# EasyEDA Pro project 连续波核磁共振.eprj

# Schematic CNMR-D-02
Create Date: 2023-07-25; Page Name: P1; Project Name: 连续波核磁共振; Schematic Name: CNMR-D-02; Update Date: 2024-09-05
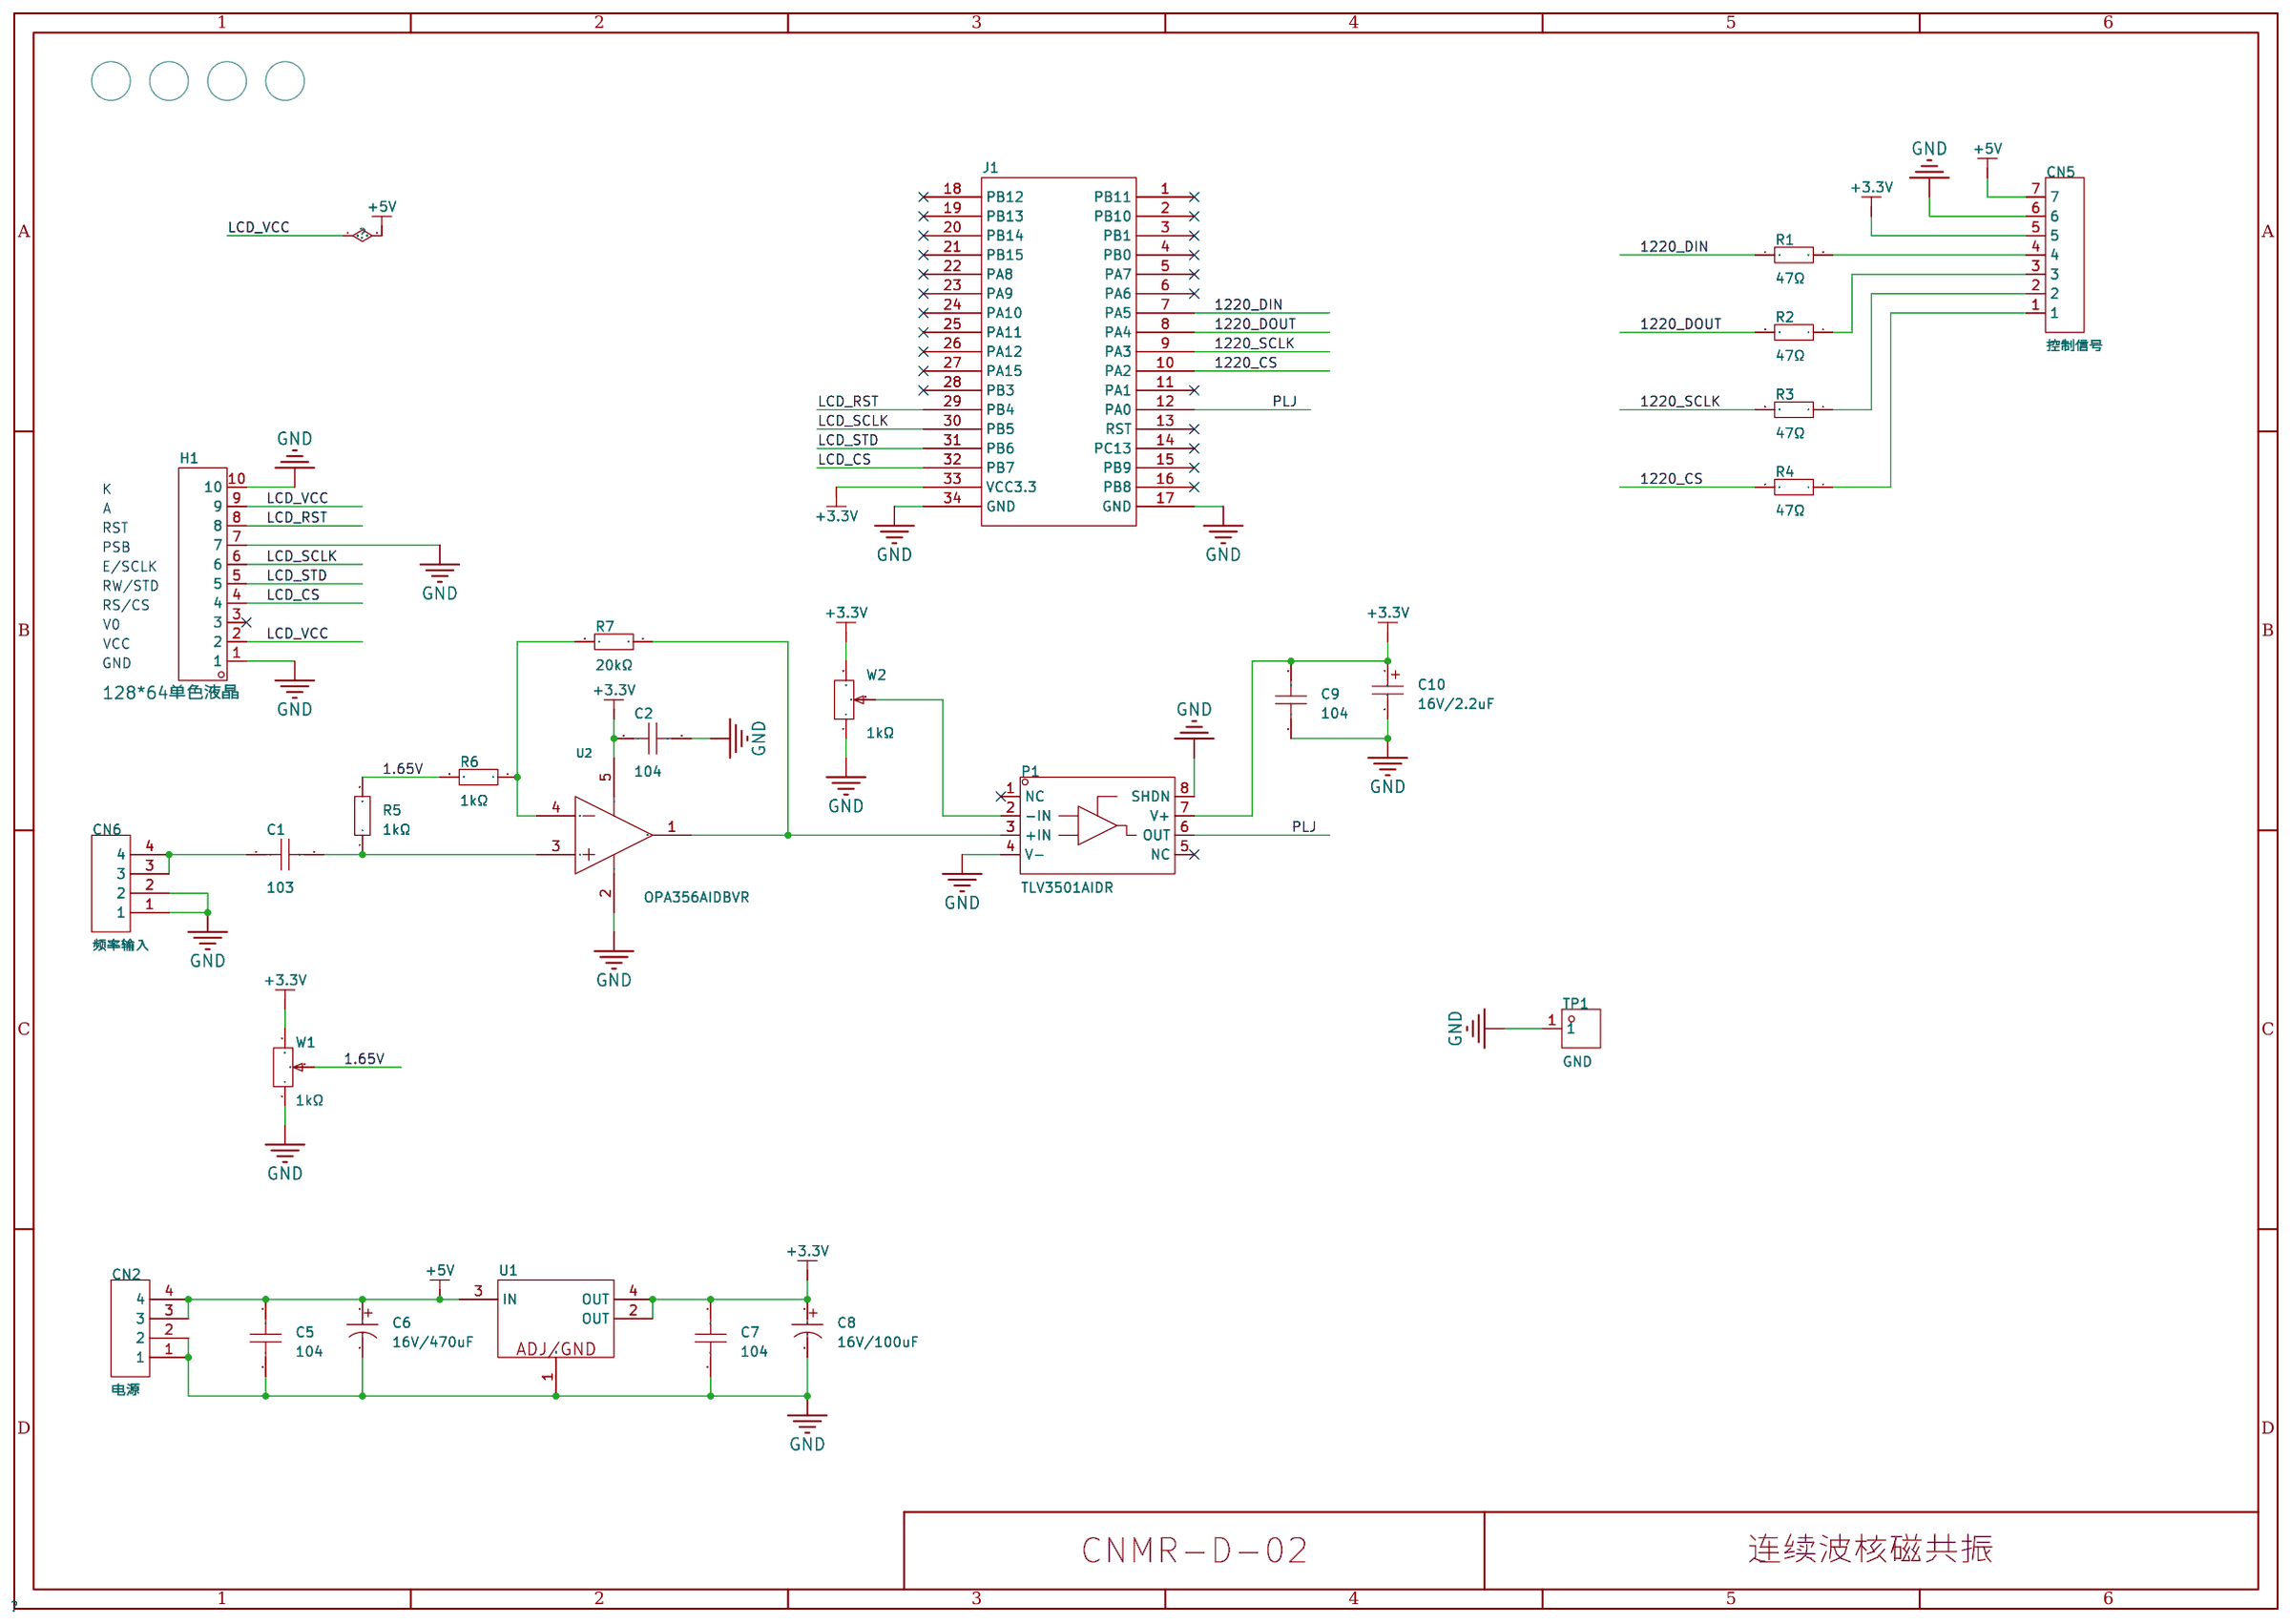
[diagram p0: schematic sheet]

## Parts
A1  -  [POST_4mm]  (no BOM)
A2  -  [POST_4mm]  (no BOM)
A3  -  [POST_4mm]  (no BOM)
A4  -  [POST_4mm]  (no BOM)
C1  103  [CAP-TH_L7.2-W4.0-P5.00-D0.5]
C2  104  [CAP-TH_L7.2-W4.0-P5.00-D0.5]
C5  104  [CAP-TH_L7.2-W4.0-P5.00-D0.5]
C6  16V/470uF  [CAP-TH_BD8.0-P3.50-D0.6-FD]
C7  104  [CAP-TH_L7.2-W4.0-P5.00-D0.5]
C8  16V/100uF  [CAP-TH_BD6.3-P2.50-D1.0-FD]
C9  104  [CAP-TH_L7.2-W4.0-P5.00-D0.5]
C10  16V/2.2uF  [CASE-A_3216]
CN2  电源  [CONN-TH_4P-P2.54_A2510S-4P]
CN5  控制信号  [CH_7P-P2.54]
CN6  频率输入  [CONN-TH_4P-P2.54_A2510S-4P]
H1  128*64单色液晶  [HDR-TH_10P-P2.54-V-M-1]
J1  -  [stm32f103c8t6xtb]
P1  TLV3501AIDR  [SOP-8_L4.9-W3.9-P1.27-LS6.0-BL]
R1  47Ω  [RES-TH_BD2.5-L6.5-P10.50-D0.6]
R2  47Ω  [RES-TH_BD2.5-L6.5-P10.50-D0.6]
R3  47Ω  [RES-TH_BD2.5-L6.5-P10.50-D0.6]
R4  47Ω  [RES-TH_BD2.5-L6.5-P10.50-D0.6]
R5  1kΩ  [RES-TH_BD2.5-L6.5-P10.50-D0.6]
R6  1kΩ  [RES-TH_BD2.5-L6.5-P10.50-D0.6]
R7  20kΩ  [RES-TH_BD2.5-L6.5-P10.50-D0.6]
TP1  GND  [TESTPOINT-TH_BD3.2]
U1  AMS1117-3.3  [SOT-223-3_L6.4-W3.5-P2.30-LS7.0-BR]
U2  OPA356AIDBVR  [SOT-23-5_L3.0-W1.7-P0.95-LS2.8-BR]
W1  1kΩ  [RES-ADJ-TH_3296W]
W2  1kΩ  [RES-ADJ-TH_3296W]

## Library data of the parts
A1-A4 = 安装孔
C1 C2 C5 C7 C9 = 104电容: 容值:100nF;精度:±5%;额定电压:100V;工作温度:-40~+105;; LCSC Part Name: 100nF ±5% 100V; Supplier Part: C333827; Manufacturer: HEL鸿志; Manufacturer Part: MES104J2A-7-50R0; Supplier Footprint: 径向引线,P=5mm; JLCPCB Part Class: 扩展库; Datasheet: https://atta.szlcsc.com/upload/public/pdf/source/20190802/C333827_0C3A382E0AFB64319515A56455BE3B3E.pdf; Supplier: LCSC; Tolerance: ±5%; Voltage Rated: 100V; Operating Temperature: -40~+105
C6 = 16V/470uF: 脚间距:3.5mm;电容体直径:8mm;精度:±20%;工作温度:-;额定电压:16V;容值:470uF;工作寿命:2000hrs 105℃;电容体长度:12mm;; Rated Voltage: 16V; Supplier: LCSC; Supplier Part: C28067; Supplier Footprint: 径向引线,8x12mm; JLCPCB Part Class: 扩展库; LCSC Part Name: 470uF 16V; Tolerance: ±20%; Datasheet: https://atta.szlcsc.com/upload/public/pdf/source/20151029/1457707512884.pdf; Manufacturer: CX(承兴); Manufacturer Part: KM477M016F12RR0VH2FP0; L: 12mm; Lead Spacing: 3.5mm; Lifetime @ Temp: 2000hrs 105℃; φD: 8mm
C8 = 16V/100uF: 纹波电流:95mA 120Hz;电容体直径:6.3mm;电容体长度:7mm;工作寿命:5000hrs 105℃;等效串联电阻:-;精度:±20%;工作温度:-;额定电压:16V;容值:100uF;脚间距:2.5mm;; Rated Voltage: 16V; Supplier: LCSC; Supplier Part: C88806; Supplier Footprint: 径向引线,6.3x7mm; JLCPCB Part Class: 扩展库; LCSC Part Name: 100uF 16V; Tolerance: ±20%; Datasheet: https://atta.szlcsc.com/upload/public/pdf/source/20161125/1480067897511.pdf; Manufacturer: rubycon(红宝石); Manufacturer Part: 16ML100MEFC6.3X7; L: 7mm; Lead Spacing: 2.5mm; Lifetime @ Temp: 5000hrs 105℃; Ripple Current: 95mA 120Hz; φD: 6.3mm
C10 = TAJA225K016RNJ: 容值:2.2uF;精度:±10%;额定电压:16V;等效串联电阻:6.5Ω@100kHz;; LCSC Part Name: 2.2uF ±10% 16V; Supplier Part: C7180; Manufacturer: Kyocera AVX; Supplier Footprint: CASE-A-3216; JLCPCB Part Class: Extended Part; Datasheet: https://atta.szlcsc.com/upload/public/pdf/source/20160107/1457707748378.pdf; Supplier: LCSC; Tolerance: ±10%; Rated Voltage: 16V; Equivalent Series Resistance(ESR): 6.5Ω@100kHz; Operating Temperature: -55℃~+125℃
CN2 CN6 = 2.54mm4芯插座: 参考系列:-;间距:2.54mm;插针结构:1x4P;排数:1;每排PIN数:4;行距:-;安装方式:-;触头材质:黄铜;; LCSC Part Name: MX2.54 2510系列 插座 1*4P 2.54mm 直针米黄; Supplier Part: C140769; Manufacturer: Ckmtw(灿科盟); Manufacturer Part: W-2510S04P-0000; Supplier Footprint: 插件,P=2.54mm; JLCPCB Part Class: 扩展库; Datasheet: https://atta.szlcsc.com/upload/public/pdf/source/20180423/C140769_E5973268EE8E03CF1A982B681C4FAED0.pdf; Supplier: LCSC; Pitch: 2.54mm; Pins Structure: 1x4P; Number of Rows: 1; Number of PINs Per Row: 4; Contact Material: 黄铜
CN5 = 2.54mm7芯插座: 参考系列:-;间距:2.54mm;插针结构:1x7P;排数:1;每排PIN数:7;行距:-;安装方式:-;触头材质:黄铜;; LCSC Part Name: MX2.54 2510系列 插座 1*7P 2.54mm 直针; Supplier Part: C169037; Manufacturer: Ckmtw(灿科盟); Manufacturer Part: W-2510S07P-0000; Supplier Footprint: 插件,P=2.54mm; JLCPCB Part Class: Extended Part; Datasheet: https://atta.szlcsc.com/upload/public/pdf/source/20180112/C169037_15157258973731261780.pdf; Supplier: LCSC; Pitch: 2.54mm; Pins Structure: 1x7P; Number of Rows: 1; Number of PINs Per Row: 7; Contact Material: 黄铜
H1 = 2.54-1*10P针: 间距:2.54mm;总PIN位数:10;排数:1;插针结构:1x10P;行距:-;安装类型:直插;圆针/方针:方针;额定电流:3A;额定电压:-;配合针长度:-;塑高:-;端接针长度:-;触头材质:-;触头镀层:-;工作温度范围:-40~+105;颜色:黑色;; LCSC Part Name: 2.54mm 1x10P 直插 方针; Supplier Part: C57369; Manufacturer: BOOMELE(博穆精密); Supplier Footprint: 插件,P=2.54mm; JLCPCB Part Class: Extended Part; Datasheet: https://atta.szlcsc.com/upload/public/pdf/source/20151109/1457707572883.pdf; Supplier: LCSC; Pitch: 2.54mm; Number of Pins: 10; Number of Rows: 1; Pin Structure: 1x10P; Mounting Type: 直插; Circluar Pins/Square Pins: 方针; Current Rating (Max): 3A; Operating Temperature Range: -40~+105; Color: 黑色
J1 = stm32f103c8t6小系统板
P1 = TLV3501AIDR: 比较器组数:1;电源电压:2.7V ~ 5.5V, ±1.35V ~ 2.75V;各通道供电电流:5mA;输出类型:CMOS, Push-Pull, Rail-to-Rail, TTL;传播延迟:10ns;; Supplier Part: C43484; Manufacturer: TI(德州仪器); Supplier Footprint: SOP-8_150mil; JLCPCB Part Class: 扩展库; Datasheet: https://atta.szlcsc.com/upload/public/pdf/source/20150319/1457707268212.pdf; Supplier: LCSC; Number of Elements: 1; Supply Voltage（Single）: 2.7V ~ 5.5V, ±1.35V ~ 2.75V; Iq per channel (Typ): 5mA; Output Type: CMOS, Push-Pull, Rail-to-Rail, TTL; Propagation Delay (Max): 10ns; Operating Temperature: -40°C ~ 125°C
R1-R4 = 1/4W电阻: 电阻类型:金属膜电阻;阻值:1kΩ;精度:±1%;功率:250mW;温度系数:±50ppm/;; LCSC Part Name: 1kΩ ±1% 250mW; Supplier Part: C57435; Manufacturer: UNI-ROYAL(厚声); Manufacturer Part: MFR0W4F1001A50; Supplier Footprint: 轴向引线; JLCPCB Part Class: Extended Part; Datasheet: https://atta.szlcsc.com/upload/public/pdf/source/20170615/1497511028539.pdf; Supplier: LCSC; Type: 金属膜电阻; Tolerance: ±1%; Power(Watts): 250mW; Temperature Coefficient: ±50ppm/
R5-R7 = 1/4W电阻: 电阻类型:金属膜电阻;阻值:1kΩ;精度:±1%;功率:250mW;温度系数:±50ppm/℃;; LCSC Part Name: 1kΩ ±1% 250mW; Supplier Part: C57435; Manufacturer: UNI-ROYAL(厚声); Manufacturer Part: MFR0W4F1001A50; Supplier Footprint: 轴向引线; JLCPCB Part Class: Extended Part; Datasheet: https://atta.szlcsc.com/upload/public/pdf/source/20170615/1497511028539.pdf; Supplier: LCSC; Type: 金属膜电阻; Tolerance: ±1%; Power(Watts): 250mW; Temperature Coefficient: ±50ppm/℃
TP1 = 测试点: LCSC Part Name: TP-黄色测试点; Supplier Part: C9900007422; Manufacturer Part: TP-黄色测试点; Supplier Footprint: TESTPOINT-TH_BD-2P-P2.00; JLCPCB Part Class: 扩展库; Datasheet: https://atta.szlcsc.comnull; Supplier: LCSC
U1 = AMS1117-3.3: Supplier Part: C2992570; Manufacturer: 国芯佳品; Supplier Footprint: SOT-223; JLCPCB Part Class: Extended Part; Datasheet: https://atta.szlcsc.com/upload/public/pdf/source/20220729/0D21C21EC310E4778671BF6BAE438640.pdf; Supplier: LCSC
U2 = OPA356AIDBVR: 放大器组数:1;带宽(-3db):450MHz;输入偏置电流(Ib):3pA;增益带宽积(GBP):200MHz;压摆率(SR):360V/us;轨到轨:轨到轨;; Supplier Part: C183100; Manufacturer: TI(德州仪器); Supplier Footprint: SOT-23-5; JLCPCB Part Class: Extended Part; Datasheet: https://www.ti.com/cn/lit/gpn/opa356; Supplier: LCSC; Number of Circuits: 1; -3db Bandwidth: 450MHz; Current - Input Bias(Ib): 3pA; Gain Bandwidth Product(GBP): 200MHz; Slew Rate(SR): 360V/us; Rail to Rail: 轨到轨; Output Current: 100mA; Operating Temperature: -40℃~+125℃
W1 W2 = 3296W: 阻值:1kΩ;精度:±10%;温度系数:±100ppm/℃;; LCSC Part Name: 1kΩ ±10%; Supplier Part: C57089; Manufacturer: BOURNS; Manufacturer Part: 3296W-1-102LF; JLCPCB Part Class: Extended Part; Datasheet: https://atta.szlcsc.com/upload/public/pdf/source/20151026/1457707506403.pdf; Supplier: LCSC; Tolerance: ±10%; Temperature Coefficient: ±100ppm/℃

## Nets
1.65V: R5.2 R6.2 W1.2
+3.3V: C2.1 C7.1 C8.1 C9.1 C10.1 CN5.5 J1.33(VCC3.3) P1.7(V+) U1.2(OUT) U1.4(OUT) U2.5(V+) W1.3 W2.3
+5V: C5.1 C6.1 CN2.3 CN2.4 CN5.7 H1.2 H1.9 U1.3(IN)
GND: C2.2 C5.2 C6.2 C7.2 C8.2 C9.2 C10.2 CN2.1 CN2.2 CN5.6 CN6.1 CN6.2 H1.1 H1.7 H1.10 J1.17(GND) J1.34(GND) P1.4(V-) P1.8(SHDN) TP1.1 U1.1(ADJ/GND) U2.2(V-) W1.1 W2.1
1220_CS: J1.10(PA2) R4.2
1220_DIN: J1.7(PA5) R1.1
1220_DOUT: J1.8(PA4) R2.2
1220_SCLK: J1.9(PA3) R3.2
LCD_CS: H1.4 J1.32(PB7)
LCD_RST: H1.8 J1.29(PB4)
LCD_SCLK: H1.6 J1.30(PB5)
LCD_STD: H1.5 J1.31(PB6)
PLJ: J1.12(PA0) P1.6(OUT)
$1N6805: P1.3(+IN) R7.1 U2.1(OUT)
$1N8685: CN5.4 R1.2
$1N8688: CN5.3 R2.1
$1N8693: CN5.2 R3.1
$1N8698: CN5.1 R4.1
$1N10463: C1.1 CN6.3 CN6.4
$1N10636: C1.2 R5.1 U2.3(IN+)
$1N10673: R6.1 R7.2 U2.4(IN-)
$1N10727: P1.2(-IN) W2.2

Not connected (* = marked no-connect by the designer): H1 3*; J1 1(PB11)* 2(PB10)* 3(PB1)* 4(PB0)* 5(PA7)* 6(PA6)* 11(PA1)* 13(RST)* 14(PC13)* 15(PB9)* 16(PB8)* 18(PB12)* 19(PB13)* 20(PB14)* 21(PB15)* 22(PA8)* 23(PA9)* 24(PA10)* 25(PA11)* 26(PA12)* 27(PA15)* 28(PB3)*; P1 1(NC)* 5(NC)*

## Notes on the sheet
- K
- A
- RST
- PSB
- E/SCLK
- RW/STD
- RS/CS
- V0
- VCC
- GND

# Schematic CNMR-D-01
Create Date: 2023-07-25; Page Name: P1; Project Name: 连续波核磁共振; Schematic Name: CNMR-D-01; Update Date: 2023-11-03
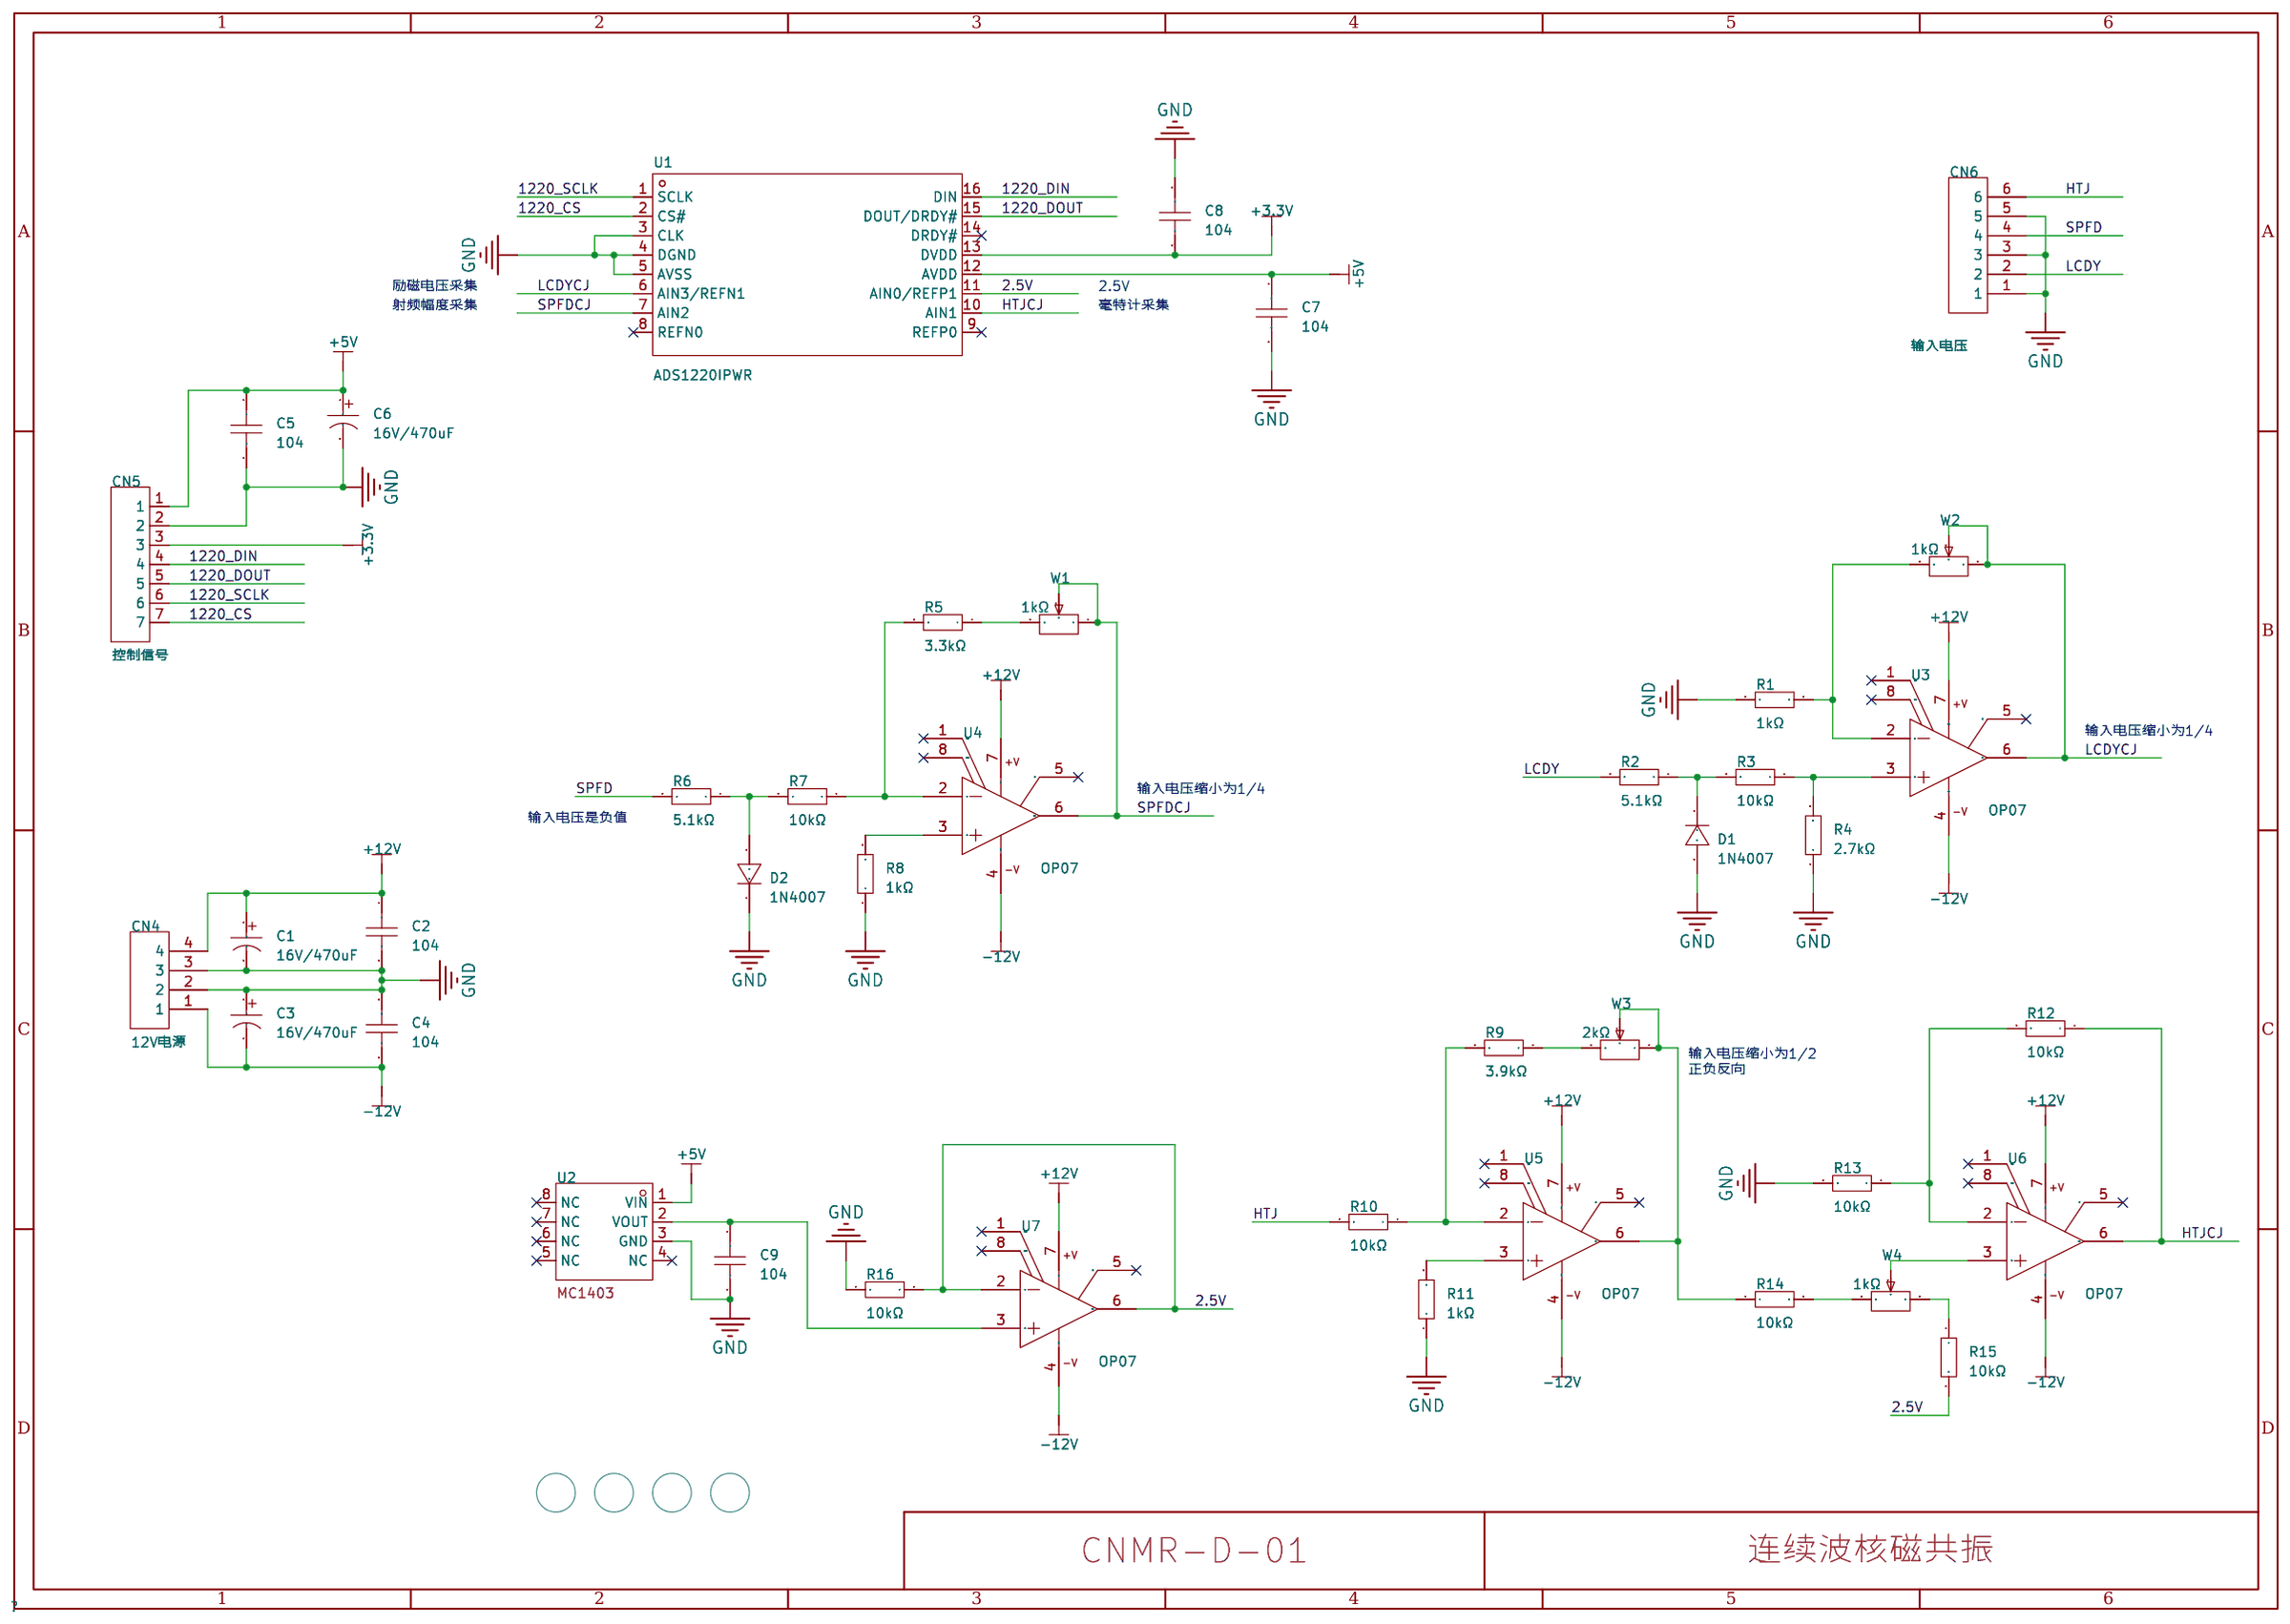
[diagram p1: schematic sheet]

## Parts
A1  -  [POST_4mm]  (no BOM)
A2  -  [POST_4mm]  (no BOM)
A3  -  [POST_4mm]  (no BOM)
A4  -  [POST_4mm]  (no BOM)
C1  16V/470uF  [CAP-TH_BD8.0-P3.50-D0.6-FD]
C2  104  [CAP-TH_L7.2-W4.0-P5.00-D0.5]
C3  16V/470uF  [CAP-TH_BD8.0-P3.50-D0.6-FD]
C4  104  [CAP-TH_L7.2-W4.0-P5.00-D0.5]
C5  104  [CAP-TH_L7.2-W4.0-P5.00-D0.5]
C6  16V/470uF  [CAP-TH_BD8.0-P3.50-D0.6-FD]
C7  104  [CAP-TH_L7.2-W4.0-P5.00-D0.5]
C8  104  [CAP-TH_L7.2-W4.0-P5.00-D0.5]
C9  104  [CAP-TH_L7.2-W4.0-P5.00-D0.5]
CN4  12V电源  [CONN-TH_4P-P2.54_A2510S-4P]
CN5  控制信号  [CH_7P-P2.54]
CN6  输入电压  [CH_6P-P2.54]
D1  1N4007  [DO-41_BD2.4-L4.7-P8.70-D0.9-RD]
D2  1N4007  [DO-41_BD2.4-L4.7-P8.70-D0.9-RD]
R1  1kΩ  [RES-TH_BD2.5-L6.5-P10.50-D0.6]
R2  5.1kΩ  [RES-TH_BD2.5-L6.5-P10.50-D0.6]
R3  10kΩ  [RES-TH_BD2.5-L6.5-P10.50-D0.6]
R4  2.7kΩ  [RES-TH_BD2.5-L6.5-P10.50-D0.6]
R5  3.3kΩ  [RES-TH_BD2.5-L6.5-P10.50-D0.6]
R6  5.1kΩ  [RES-TH_BD2.5-L6.5-P10.50-D0.6]
R7  10kΩ  [RES-TH_BD2.5-L6.5-P10.50-D0.6]
R8  1kΩ  [RES-TH_BD2.5-L6.5-P10.50-D0.6]
R9  3.9kΩ  [RES-TH_BD2.5-L6.5-P10.50-D0.6]
R10  10kΩ  [RES-TH_BD2.5-L6.5-P10.50-D0.6]
R11  1kΩ  [RES-TH_BD2.5-L6.5-P10.50-D0.6]
R12  10kΩ  [RES-TH_BD2.5-L6.5-P10.50-D0.6]
R13  10kΩ  [RES-TH_BD2.5-L6.5-P10.50-D0.6]
R14  10kΩ  [RES-TH_BD2.5-L6.5-P10.50-D0.6]
R15  10kΩ  [RES-TH_BD2.5-L6.5-P10.50-D0.6]
R16  10kΩ  [RES-TH_BD2.5-L6.5-P10.50-D0.6]
U1  ADS1220IPWR  [TSSOP-16_L5.0-W4.4-P0.65-LS6.4-BL]
U2  MC1403  [DIP-8_L9.7-W6.4-P2.54-LS7.6-BL]
U3  OP07  [DIP-8_L8.8-W6.4-P2.54-LS7.6-BL]
U4  OP07  [DIP-8_L8.8-W6.4-P2.54-LS7.6-BL]
U5  OP07  [DIP-8_L8.8-W6.4-P2.54-LS7.6-BL]
U6  OP07  [DIP-8_L8.8-W6.4-P2.54-LS7.6-BL]
U7  OP07  [DIP-8_L8.8-W6.4-P2.54-LS7.6-BL]
W1  1kΩ  [RES-ADJ-TH_3296W]
W2  1kΩ  [RES-ADJ-TH_3296W]
W3  2kΩ  [RES-ADJ-TH_3296W]
W4  1kΩ  [RES-ADJ-TH_3296W]

## Library data of the parts
A1-A4 = 安装孔
C1 C3 C6 = 16V/470uF: 脚间距:3.5mm;电容体直径:8mm;精度:±20%;工作温度:-;额定电压:16V;容值:470uF;工作寿命:2000hrs 105℃;电容体长度:12mm;; Rated Voltage: 16V; Supplier: LCSC; Supplier Part: C28067; Supplier Footprint: 径向引线,8x12mm; JLCPCB Part Class: 扩展库; LCSC Part Name: 470uF 16V; Tolerance: ±20%; Datasheet: https://atta.szlcsc.com/upload/public/pdf/source/20151029/1457707512884.pdf; Manufacturer: CX(承兴); Manufacturer Part: KM477M016F12RR0VH2FP0; L: 12mm; Lead Spacing: 3.5mm; Lifetime @ Temp: 2000hrs 105℃; φD: 8mm
C2 C4 C5 C7-C9 = 104电容: 容值:100nF;精度:±5%;额定电压:100V;工作温度:-40~+105;; LCSC Part Name: 100nF ±5% 100V; Supplier Part: C333827; Manufacturer: HEL鸿志; Manufacturer Part: MES104J2A-7-50R0; Supplier Footprint: 径向引线,P=5mm; JLCPCB Part Class: Extended Part; Datasheet: https://atta.szlcsc.com/upload/public/pdf/source/20190802/C333827_0C3A382E0AFB64319515A56455BE3B3E.pdf; Supplier: LCSC; Tolerance: ±5%; Voltage Rated: 100V; Operating Temperature: -40~+105
CN4 = 2.54mm4芯插座: 参考系列:-;间距:2.54mm;插针结构:1x4P;排数:1;每排PIN数:4;行距:-;安装方式:-;触头材质:黄铜;; LCSC Part Name: MX2.54 2510系列 插座 1*4P 2.54mm 直针米黄; Supplier Part: C140769; Manufacturer: Ckmtw(灿科盟); Manufacturer Part: W-2510S04P-0000; Supplier Footprint: 插件,P=2.54mm; JLCPCB Part Class: 扩展库; Datasheet: https://atta.szlcsc.com/upload/public/pdf/source/20180423/C140769_E5973268EE8E03CF1A982B681C4FAED0.pdf; Supplier: LCSC; Pitch: 2.54mm; Pins Structure: 1x4P; Number of Rows: 1; Number of PINs Per Row: 4; Contact Material: 黄铜
CN5 = 2.54mm7芯插座: 参考系列:-;间距:2.54mm;插针结构:1x7P;排数:1;每排PIN数:7;行距:-;安装方式:-;触头材质:黄铜;; LCSC Part Name: MX2.54 2510系列 插座 1*7P 2.54mm 直针; Supplier Part: C169037; Manufacturer: Ckmtw(灿科盟); Manufacturer Part: W-2510S07P-0000; Supplier Footprint: 插件,P=2.54mm; JLCPCB Part Class: Extended Part; Datasheet: https://atta.szlcsc.com/upload/public/pdf/source/20180112/C169037_15157258973731261780.pdf; Supplier: LCSC; Pitch: 2.54mm; Pins Structure: 1x7P; Number of Rows: 1; Number of PINs Per Row: 7; Contact Material: 黄铜
CN6 = 2.54mm6芯插座: 参考系列:-;间距:2.54mm;插针结构:1x6P;排数:1;每排PIN数:6;行距:-;安装方式:-;触头材质:黄铜;; LCSC Part Name: MX2.54 2510系列 插座 1*6P 2.54mm 直针米黄; Supplier Part: C140771; Manufacturer: Ckmtw(灿科盟); Manufacturer Part: W-2510S06P-0000; Supplier Footprint: 插件,P=2.54mm; JLCPCB Part Class: 扩展库; Datasheet: https://atta.szlcsc.com/upload/public/pdf/source/20180423/C140771_FD5A324D6D370E9869CD4290787689D6.pdf; Supplier: LCSC; Pitch: 2.54mm; Pins Structure: 1x6P; Number of Rows: 1; Number of PINs Per Row: 6; Contact Material: 黄铜
D1 D2 = 1N4007: Supplier: LCSC; Supplier Part: C402311; Supplier Footprint: DO-41; JLCPCB Part Class: 扩展库; Datasheet: https://atta.szlcsc.com/upload/public/pdf/source/20190705/C402311_D2D67FF606A14042155DA6DAFA20C736.pdf; Manufacturer: LGE(鲁光)
R1-R16 = 1/4W电阻: 电阻类型:金属膜电阻;阻值:1kΩ;精度:±1%;功率:250mW;温度系数:±50ppm/℃;; LCSC Part Name: 1kΩ ±1% 250mW; Supplier Part: C57435; Manufacturer: UNI-ROYAL(厚声); Manufacturer Part: MFR0W4F1001A50; Supplier Footprint: 轴向引线; JLCPCB Part Class: Extended Part; Datasheet: https://atta.szlcsc.com/upload/public/pdf/source/20170615/1497511028539.pdf; Supplier: LCSC; Type: 金属膜电阻; Tolerance: ±1%; Power(Watts): 250mW; Temperature Coefficient: ±50ppm/℃
U1 = ADS1220IPWR: 接口:SPI;采样率:2kHz;分辨率:24位;电源电压:2.3V~5.5V;; Supplier Part: C48263; Manufacturer: TI(德州仪器); Supplier Footprint: TSSOP-16; JLCPCB Part Class: 扩展库; Datasheet: https://www.ti.com/cn/lit/gpn/ads1220; Supplier: LCSC; Interface: SPI; differential input: 是; number of channels: 2；4; sampling frequency: 2kHz; resolution: 24位; Supply Voltage: 2.3V~5.5V; Operating Temperature: -40℃~+125℃
U2 = MC1403N: LCSC Part Name: 高精度低漂移能隙基准电源; Supplier Part: C518921; Manufacturer: HGSEMI(华冠); Supplier Footprint: DIP-8; JLCPCB Part Class: Extended Part; Datasheet: https://atta.szlcsc.com/upload/public/pdf/source/20191107/C444398_49E154FA74D6B2E76C2618281F5FBF01.pdf; Supplier: LCSC
U3-U7 = OP07: 运放类型:-;放大器组数:-;增益带宽积（GBP）:-;压摆率（SR）:-;电源电压:-;各通道供电电流:-;; LCSC Part Name: 非斩波稳零的双极性(双电源供电)运算放大器集成电路; Supplier Part: C507138; Manufacturer: HGSEMI(华冠); Manufacturer Part: OP07N; Supplier Footprint: DIP-8; JLCPCB Part Class: 扩展库; Datasheet: https://atta.szlcsc.com/upload/public/pdf/source/20211018/477D8740EFCD9B37E17BAFAA0BE9F00A.pdf; Supplier: LCSC
W1-W4 = 3296W: 阻值:1kΩ;精度:±10%;温度系数:±100ppm/℃;; LCSC Part Name: 1kΩ ±10%; Supplier Part: C57089; Manufacturer: BOURNS; Manufacturer Part: 3296W-1-102LF; JLCPCB Part Class: Extended Part; Datasheet: https://atta.szlcsc.com/upload/public/pdf/source/20151026/1457707506403.pdf; Supplier: LCSC; Tolerance: ±10%; Temperature Coefficient: ±100ppm/℃

## Nets
2.5V: R15.2 R16.2 U1.11(AIN0/REFP1) U7.2(IN-) U7.6(OUT)
+3.3V: C8.1 CN5.3 U1.13(DVDD)
+5V: C5.1 C6.1 C7.1 CN5.1 U1.12(AVDD) U2.1(VIN)
+12V: C1.1 C2.1 CN4.4 U3.7(VCC+) U4.7(VCC+) U5.7(VCC+) U6.7(VCC+) U7.7(VCC+)
-12V: C3.2 C4.2 CN4.1 U3.4(VCC-) U4.4(VCC-) U5.4(VCC-) U6.4(VCC-) U7.4(VCC-)
GND: C1.2 C2.2 C3.1 C4.1 C5.2 C6.2 C7.2 C8.2 C9.2 CN4.2 CN4.3 CN5.2 CN6.1 CN6.3 CN6.5 D1.2 D2.1 R1.2 R4.1 R8.1 R11.1 R13.2 R16.1 U1.3(CLK) U1.4(DGND) U1.5(AVSS) U2.3(GND)
1220_CS: CN5.7 U1.2(CS#)
1220_DIN: CN5.4 U1.16(DIN)
1220_DOUT: CN5.5 U1.15(DOUT/DRDY#)
1220_SCLK: CN5.6 U1.1(SCLK)
HTJ: CN6.6 R10.2
HTJCJ: R12.1 U1.10(AIN1) U6.6(OUT)
LCDY: CN6.2 R2.2
LCDYCJ: U1.6(AIN3/REFN1) U3.6(OUT) W2.1 W2.2
SPFD: CN6.4 R6.2
SPFDCJ: U1.7(AIN2) U4.6(OUT) W1.1 W1.2
$1N38292: D1.1 R2.1 R3.2
$1N39030: R3.1 R4.2 U3.3(IN+)
$1N39217: R1.1 U3.2(IN-) W2.3
$1N40668: D2.2 R6.1 R7.2
$1N42755: R5.1 W1.3
$1N42829: R8.2 U4.3(IN+)
$1N42908: R5.2 R7.1 U4.2(IN-)
$1N44133: R11.2 U5.3(IN+)
$1N44135: R9.1 W3.3
$1N44142: R9.2 R10.1 U5.2(IN-)
$1N44433: U6.3(IN+) W4.2
$1N44437: R14.2 W4.3
$1N44441: R15.1 W4.1
$1N44491: R14.1 U5.6(OUT) W3.1 W3.2
$1N44512: R12.2 R13.1 U6.2(IN-)
$1N44757: C9.1 U2.2(VOUT) U7.3(IN+)

Not connected (* = marked no-connect by the designer): U1 8(REFN0)* 9(REFP0)* 14(DRDY#)*; U2 4(NC)* 5(NC)* 6(NC)* 7(NC)* 8(NC)*; U3 1(OFFSET N1)* 5(NC)* 8(OFFSET N2)*; U4 1(OFFSET N1)* 5(NC)* 8(OFFSET N2)*; U5 1(OFFSET N1)* 5(NC)* 8(OFFSET N2)*; U6 1(OFFSET N1)* 5(NC)* 8(OFFSET N2)*; U7 1(OFFSET N1)* 5(NC)* 8(OFFSET N2)*

## Notes on the sheet
- 励磁电压采集
- 2.5V
- 射频幅度采集
- 毫特计采集
- 输入电压缩小为1/4
- 输入电压缩小为1/4
- 输入电压是负值
- 输入电压缩小为1/2
  正负反向

# Board CNMR-D-02
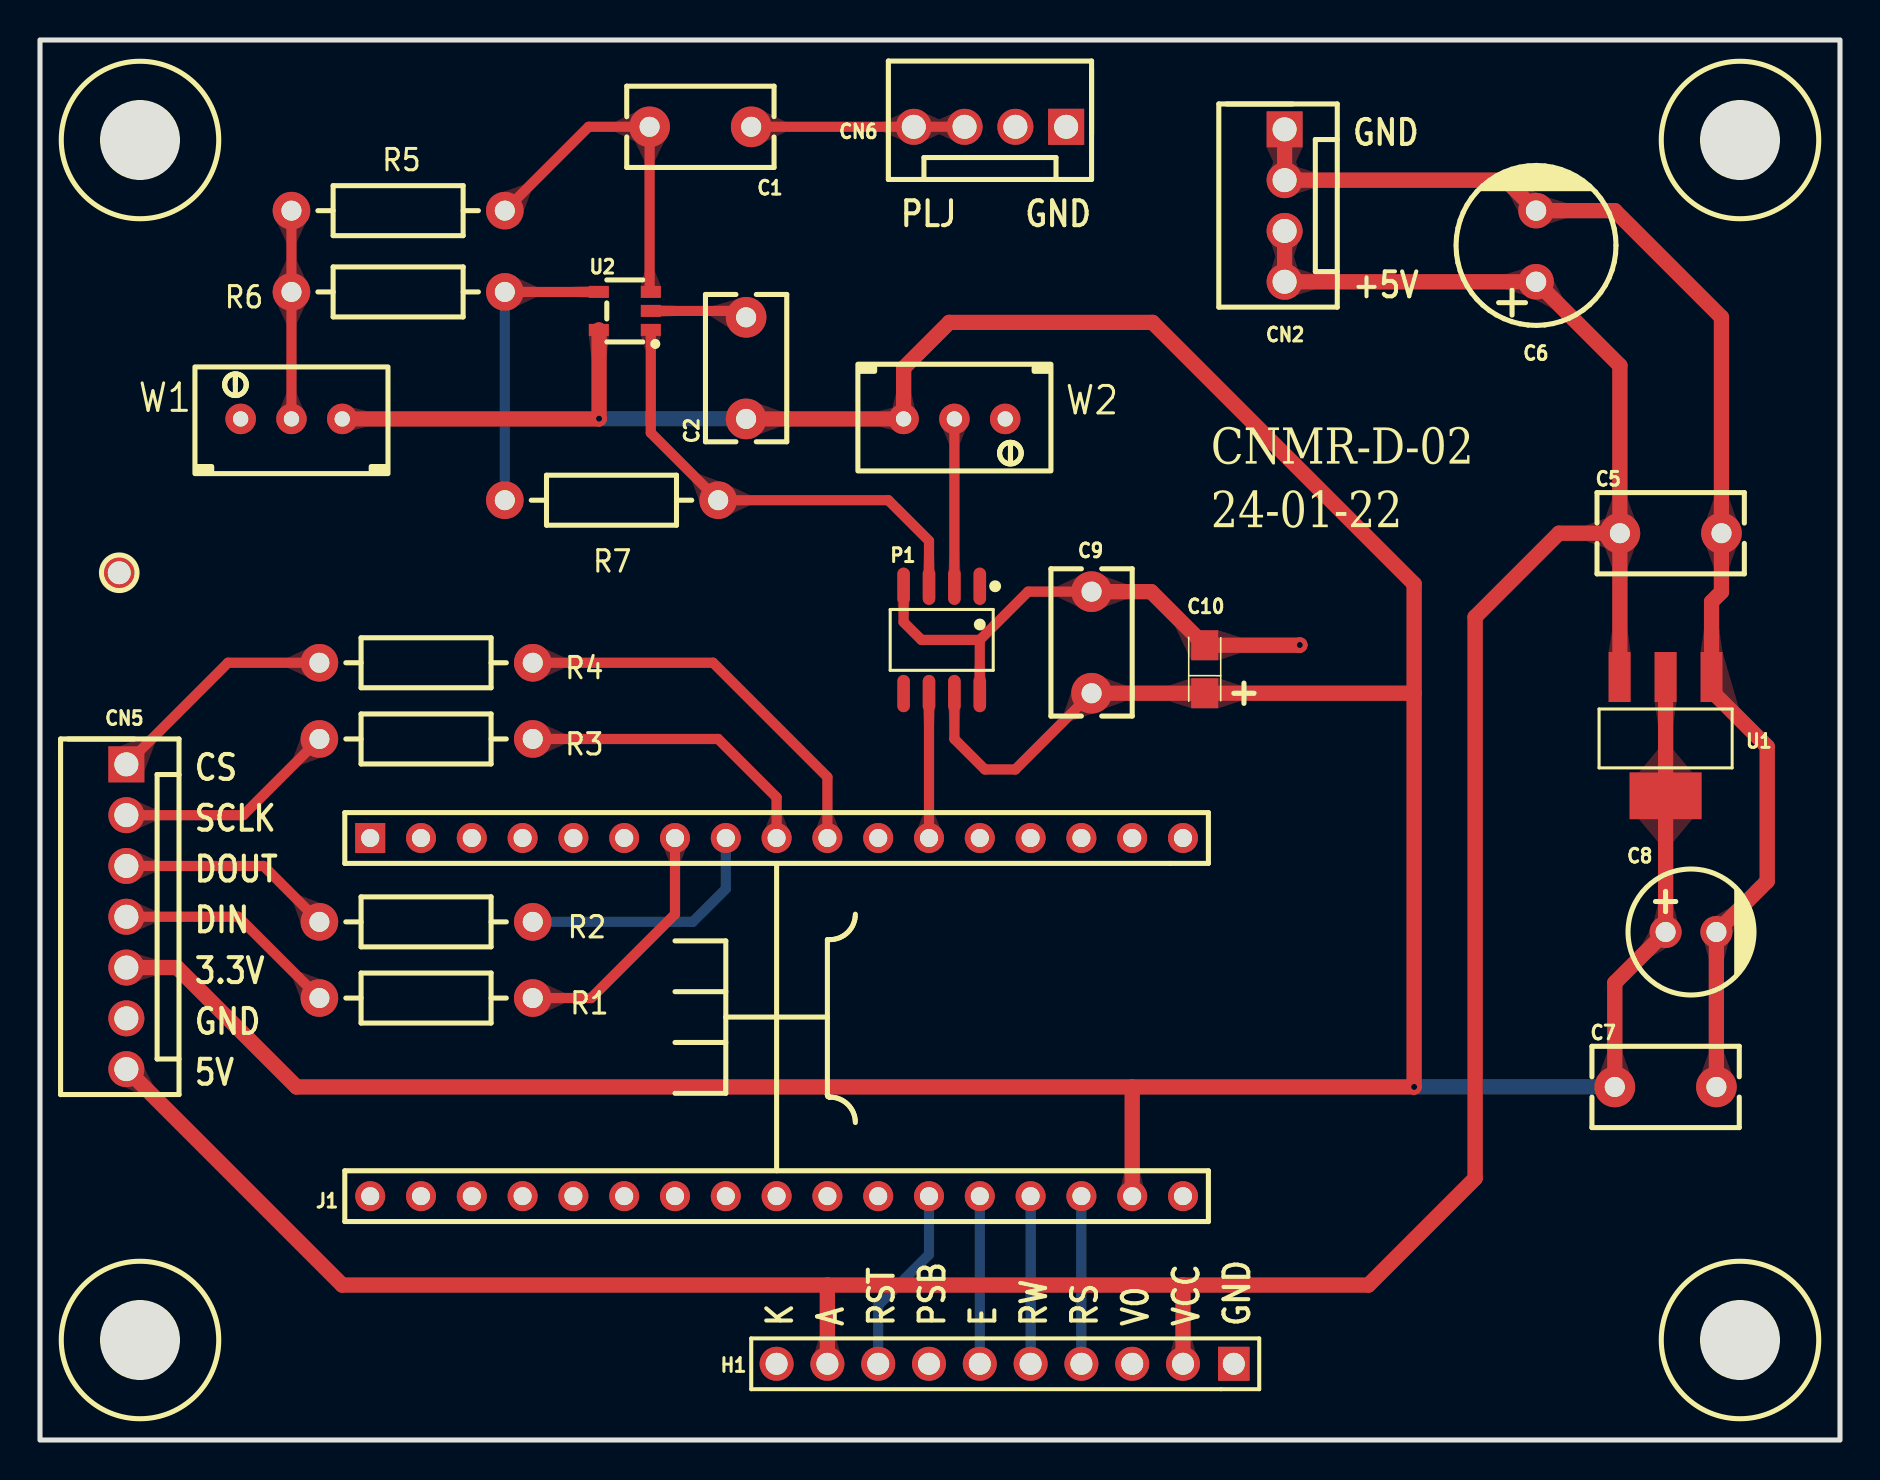
[diagram p2: board, top side]
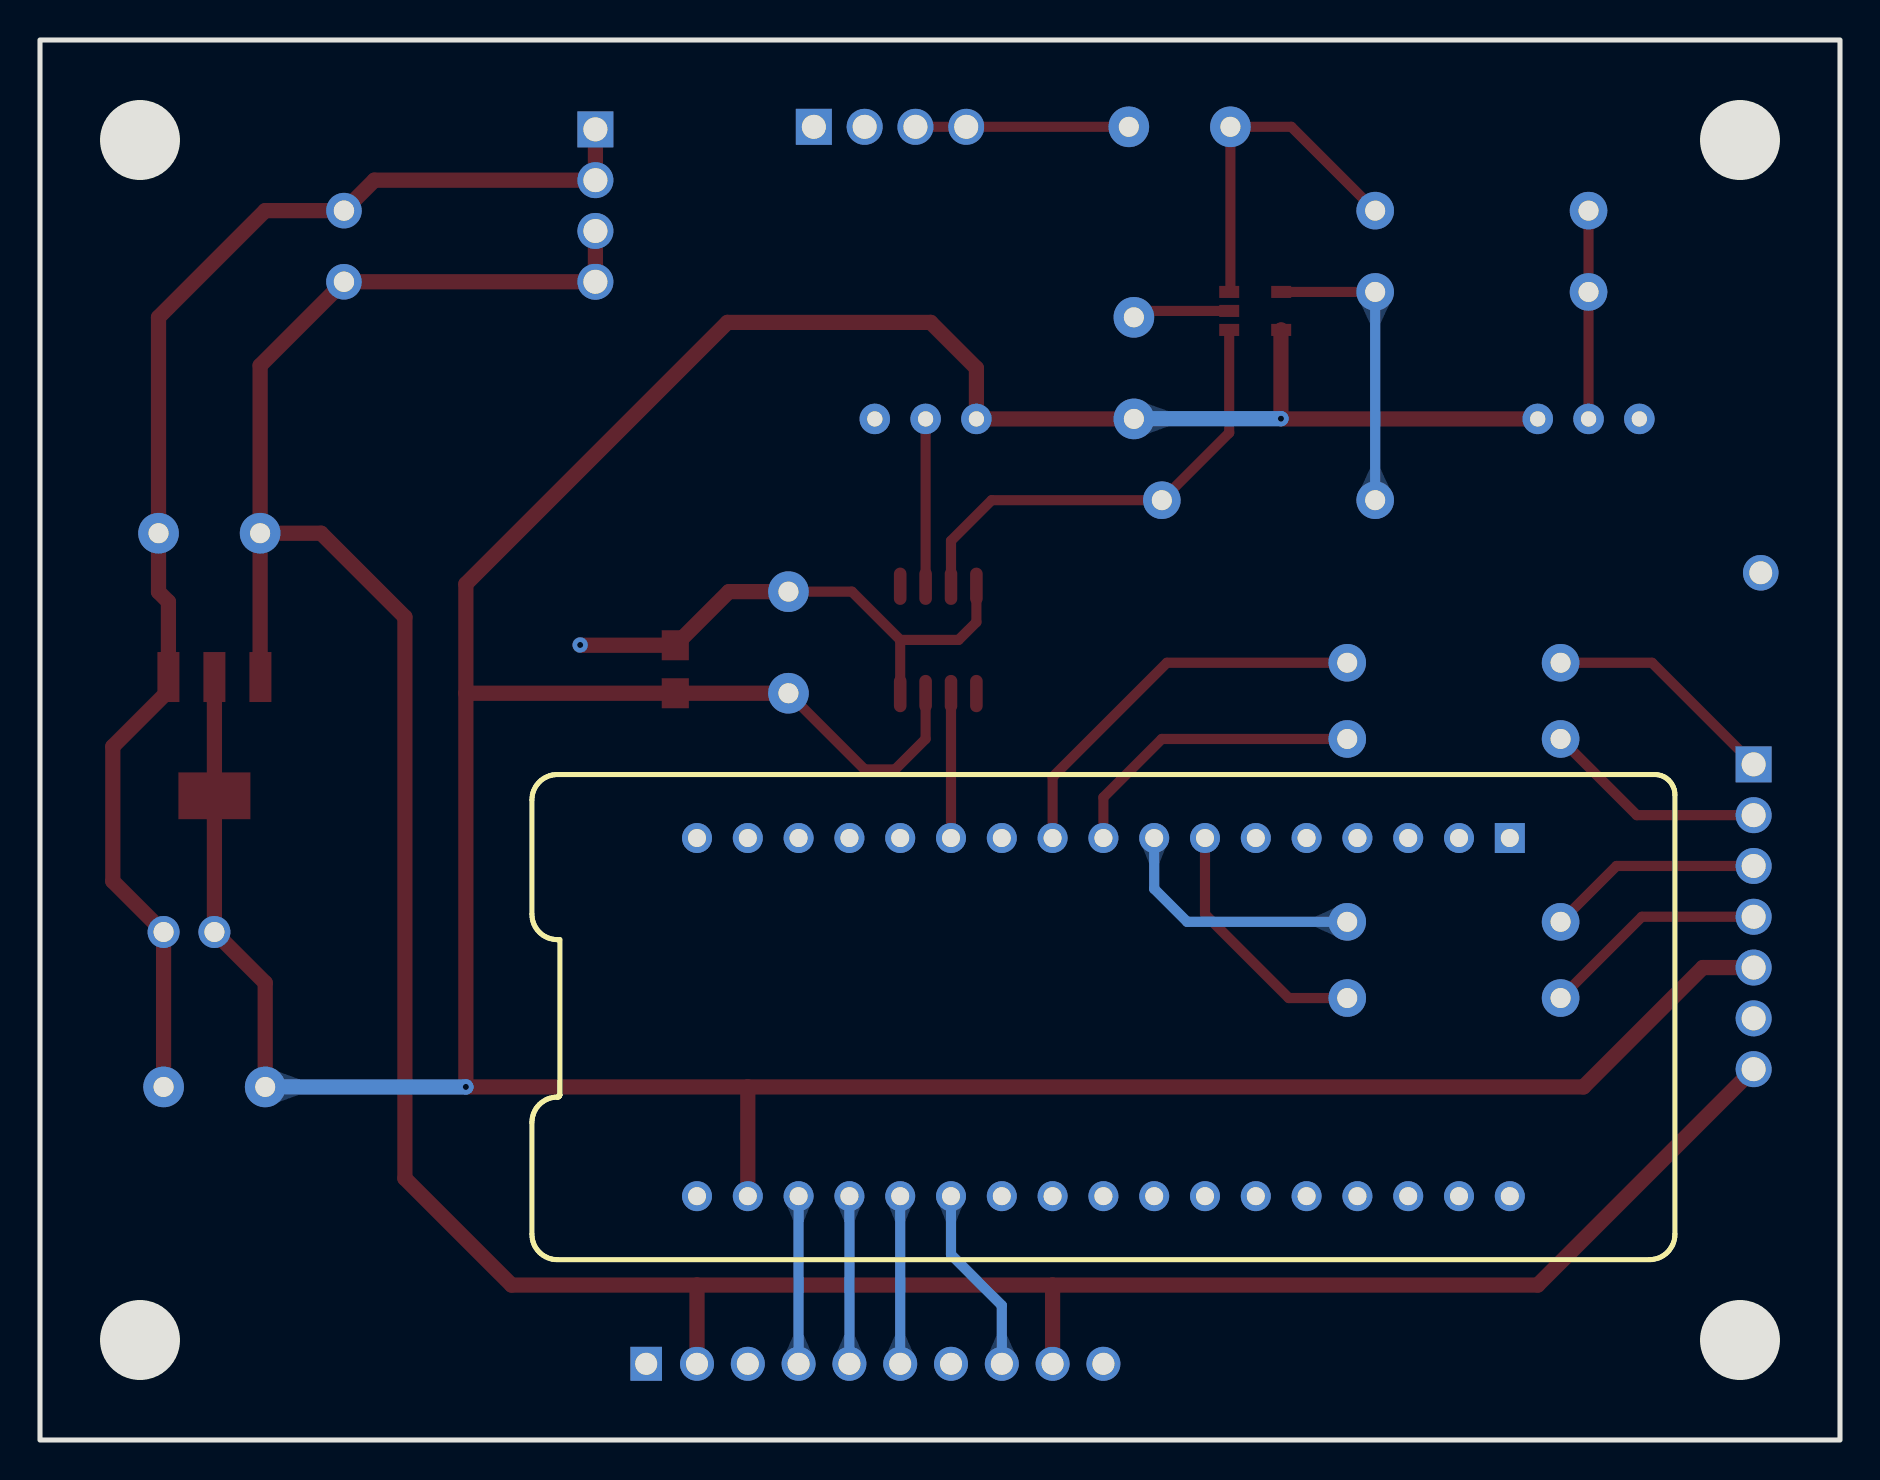
[diagram p3: board, bottom side, seen from below]

Outline 90 x 70 mm; copper layers: Top Layer, Bottom Layer. Coordinates in mm from the lower left corner of the outline.
Outline path: rectangle 0,70 90,0
Stack: Top Layer 0.035mm / Dielectric1 1.51mm FR4 er 4.5 / Bottom Layer 0.035mm

## Design rules (mm)
template: JLCPCB Capability(Two Layers Board)
spacing copperThickness1oz (default): track to track 0.102, other pairs 0.152 to 0.3
spacing copperThickness2oz: track to track 0.203, other pairs 0.152 to 0.3
track width copperThickness1oz (default): min 0.127, default 0.254, max 2.54
track width copperThickness2oz: min 0.203, default 0.254, max 2.54
differential pair differentialPair (default): width min 0.127, default 0.254, max 2.54; gap min 0.152, default 0.152
via viaSize (default): diameter min 0.5, default 0.61, max 10; hole min 0.3, default 0.305, max 6.3

## Placement (name value [footprint] x y rotation side)
A1  -  [POST_4mm]  5 5 0 top
A2  -  [POST_4mm]  5 65 0 top
A3  -  [POST_4mm]  85 5 0 top
A4  -  [POST_4mm]  85 65 0 top
C1  103  [CAP-TH_L7.2-W4.0-P5.00-D0.5]  33.02 65.66 180 top
C2  104  [CAP-TH_L7.2-W4.0-P5.00-D0.5]  35.31 53.59 90 top
C5  104  [CAP-TH_L7.2-W4.0-P5.00-D0.5]  81.53 45.34 0 top
C6  16V/470uF  [CAP-TH_BD8.0-P3.50-D0.6-FD]  74.8 59.69 90 top
C7  104  [CAP-TH_L7.2-W4.0-P5.00-D0.5]  81.28 17.65 0 top
C8  16V/100uF  [CAP-TH_BD6.3-P2.50-D1.0-FD]  82.55 25.4 0 top
C9  104  [CAP-TH_L7.2-W4.0-P5.00-D0.5]  52.58 39.88 90 top
C10  16V/2.2uF  [CASE-A_3216]  58.24 38.54 90 top
CN2  电源  [CONN-TH_4P-P2.54_A2510S-4P]  62.23 61.72 270 top
CN5  控制信号  [CH_7P-P2.54]  4.32 26.16 270 top
CN6  频率输入  [CONN-TH_4P-P2.54_A2510S-4P]  47.5 65.66 180 top
H1  128*64单色液晶  [HDR-TH_10P-P2.54-V-M-1]  48.26 3.81 180 top
J1  -  [stm32f103c8t6xtb]  16.51 30.1 90 top
P1  TLV3501AIDR  [SOP-8_L4.9-W3.9-P1.27-LS6.0-BL]  45.09 40 180 top
R1  47Ω  [RES-TH_BD2.5-L6.5-P10.50-D0.6]  19.3 22.1 180 top
R2  47Ω  [RES-TH_BD2.5-L6.5-P10.50-D0.6]  19.3 25.91 0 top
R3  47Ω  [RES-TH_BD2.5-L6.5-P10.50-D0.6]  19.3 35.05 0 top
R4  47Ω  [RES-TH_BD2.5-L6.5-P10.50-D0.6]  19.3 38.86 0 top
R5  1kΩ  [RES-TH_BD2.5-L6.5-P10.50-D0.6]  17.91 61.47 180 top
R6  1kΩ  [RES-TH_BD2.5-L6.5-P10.50-D0.6]  17.91 57.4 180 top
R7  20kΩ  [RES-TH_BD2.5-L6.5-P10.50-D0.6]  28.57 46.99 180 top
TP1  GND  [TESTPOINT-TH_BD3.2]  3.96 43.36 0 top
U1  AMS1117-3.3  [SOT-223-3_L6.4-W3.5-P2.30-LS7.0-BR]  81.28 35.18 90 top
U2  OPA356AIDBVR  [SOT-23-5_L3.0-W1.7-P0.95-LS2.8-BR]  29.24 56.45 0 top
W1  1kΩ  [RES-ADJ-TH_3296W]  12.57 51.05 90 top
W2  1kΩ  [RES-ADJ-TH_3296W]  45.72 51.05 270 top

## Footprints (pads in the part's own frame, mm; a bottom-side part is the same pattern mirrored in y, then rotated)
CAP-TH_BD6.3-P2.50-D1.0-FD
  round 1.6 hole 1: 1(-1.27,0) 2(1.27,0)
CAP-TH_BD8.0-P3.50-D0.6-FD
  round 1.778 hole 1.016: 1(-1.778,0) 2(1.778,0)
CAP-TH_L7.2-W4.0-P5.00-D0.5
  round 2.032 hole 1.001: 1(-2.54,0) 2(2.54,0)
CASE-A_3216
  rect 1.5x1.359 smd: 1(-1.2,0) 2(1.2,0)
CH_7P-P2.54
  rect 1.8x1.8 hole 1.2: 1(-7.62,0)
  round 1.8 hole 1.2: 2(-5.08,0) 3(-2.54,0) 4(0,0) 5(2.54,0) 6(5.08,0) 7(7.62,0)
CONN-TH_4P-P2.54_A2510S-4P
  rect 1.8x1.8 hole 1.2: 1(-3.81,0)
  round 1.8 hole 1.2: 2(-1.27,0) 3(1.27,0) 4(3.81,0)
HDR-TH_10P-P2.54-V-M-1
  rect 1.575x1.7 hole 1.1: 1(-11.43,0)
  round 1.7 hole 1.1: 2(-8.89,0) 3(-6.35,0) 4(-3.81,0) 5(-1.27,0) 6(1.27,0) 7(3.81,0) 8(6.35,0) 9(8.89,0) 10(11.43,0)
RES-ADJ-TH_3296W
  round 1.524 hole 0.762: 1(0,2.54) 2(0,0) 3(0,-2.54)
RES-TH_BD2.5-L6.5-P10.50-D0.6
  round 1.879 hole 1: 1(-5.334,0) 2(5.334,0)
SOP-8_L4.9-W3.9-P1.27-LS6.0-BL
  oval 0.63x1.865 smd: 1(-1.905,-2.683) 2(-0.635,-2.683) 3(0.635,-2.683) 4(1.905,-2.683) 5(1.905,2.683) 6(0.635,2.683) 7(-0.635,2.683) 8(-1.905,2.683)
SOT-23-5_L3.0-W1.7-P0.95-LS2.8-BR
  rect 1x0.6 smd: 1(1.3,-0.95) 2(1.3,0) 3(1.3,0.95) 4(-1.3,0.95) 5(-1.3,-0.95)
SOT-223-3_L6.4-W3.5-P2.30-LS7.0-BR
  rect 2.499x1.1 smd: 1(2.97,-2.299) 2(2.97,0) 3(2.97,2.301)
  rect 2.34x3.599 smd: 4(-2.97,0)
stm32f103c8t6xtb
  rect 1.5x1.5 hole 0.9: 1(0,0)
  round 1.5 hole 0.9: 2(0,-2.54) 3(0,-5.08) 4(0,-7.62) 5(0,-10.16) 6(0,-12.7) 7(0,-15.24) 8(0,-17.78) 9(0,-20.32) 10(0,-22.86) 11(0,-25.4) 12(0,-27.94) 13(0,-30.48) 14(0,-33.02) 15(0,-35.56) 16(0,-38.1) 17(0,-40.64) 18(-17.907,0) 19(-17.907,-2.54) 20(-17.907,-5.08) 21(-17.907,-7.62) 22(-17.907,-10.16) 23(-17.907,-12.7) 24(-17.907,-15.24) 25(-17.907,-17.78) 26(-17.907,-20.32) 27(-17.907,-22.86) 28(-17.907,-25.4) 29(-17.907,-27.94) 30(-17.907,-30.48) 31(-17.907,-33.02) 32(-17.907,-35.56) 33(-17.907,-38.1) 34(-17.907,-40.64)
TESTPOINT-TH_BD3.2
  round 1.778 hole 1.143: 1(0,0)

## Nets
As in the schematic.

Pads without a net: H1 3; J1 1 2 3 4 5 6 11 13 14 15 16 18 19 20 21 22 23 24 25 26 27 28; P1 1 5

## Via types
v1: diameter 0.762, hole 0.305, Top Layer to Bottom Layer, 3 vias

## Routing (per net, layer and track width the routed paths; a pad name or vN(x,y) marks a point on that pad's centre or on a via; arc(x,y) is an arc through that point)
1.65V: length 10.4
  Top Layer w0.508: R5.2 R6.2 W1.2
+3.3V: length 223.5
  Top Layer w0.508: C9.1 48.77,33.53 47.24,33.53 45.72,35.05 P1.7
  Top Layer w0.762: C7.1 78.74,22.86 C8.1 U1.4 U1.2 ; J1.33 54.61,17.65 ; 54.61,17.65 v1(68.71,17.65) 68.71,37.34 ; 54.61,17.65 12.83,17.65 6.86,23.62 CN5.5 ; 68.71,37.34 C10.1 C9.1 ; 68.71,37.34 68.71,42.8 55.63,55.88 45.47,55.88 43.18,53.59 W2.3 C2.1 ; U2.5 27.95,55.49 v1(27.95,51.07) 27.94,51.05 W1.3
  Bottom Layer w0.762: C2.1 35.29,51.07 v1(27.95,51.07) ; v1(68.71,17.65) C7.1
+5V: length 155.7
  Top Layer w0.762: CN5.7 15.11,7.75 39.37,7.75 ; 57.15,7.75 39.37,7.75 ; 57.15,7.75 66.42,7.75 71.75,13.08 71.75,41.15 75.95,45.34 C5.1 ; 57.15,7.75 H1.2 ; 39.37,7.75 H1.9 ; C5.1 78.99,38.16 U1.3 ; C5.1 78.99,53.72 C6.1 CN2.4 CN2.3
GND: length 99.8
  Top Layer w0.508: C2.2 34.99,56.45 U2.2 ; C9.2 49.4,42.42 46.99,40 ; 46.99,40 44.07,40 43.18,40.89 P1.4 ; 46.99,40 P1.8
  Top Layer w0.762: CN2.1 CN2.2 73.28,62.99 C6.2 78.74,61.47 84.07,56.13 C5.2 84.07,42.41 83.58,41.91 U1.1 83.58,37.45 86.36,34.67 86.36,27.94 C8.2 C7.2 ; v1(62.99,39.75) 62.98,39.74 C10.2 55.56,42.42 C9.2
1220_CS: length 20.1
  Top Layer w0.508: R4.2 33.66,38.86 39.37,33.15 J1.10
1220_DIN: length 12.7
  Top Layer w0.508: R1.1 27.56,22.1 31.75,26.29 J1.7
1220_DOUT: length 12.9
  Bottom Layer w0.508: R2.2 32.64,25.91 34.29,27.56 J1.8
1220_SCLK: length 15.4
  Top Layer w0.508: J1.9 36.83,32.13 33.91,35.05 R3.2
LCD_CS: length 8.4
  Bottom Layer w0.508: J1.32 H1.4
LCD_RST: length 9.4
  Bottom Layer w0.508: J1.29 44.45,9.27 41.91,6.73 H1.8
LCD_SCLK: length 8.4
  Bottom Layer w0.508: J1.30 H1.6
LCD_STD: length 8.4
  Bottom Layer w0.508: J1.31 H1.5
PLJ: length 7.2
  Top Layer w0.508: P1.6 J1.12
$1N6805: length 23.6
  Top Layer w0.508: P1.3 44.45,44.96 42.42,46.99 R7.1 30.54,50.36 U2.1
$1N8685: length 11.3
  Top Layer w0.508: CN5.4 9.91,26.16 R1.2
$1N8688: length 10.8
  Top Layer w0.508: R2.1 11.18,28.7 CN5.3
$1N8693: length 11.2
  Top Layer w0.508: CN5.2 10.16,31.24 R3.1
$1N8698: length 11.8
  Top Layer w0.508: R4.1 9.4,38.86 CN5.1
$1N10463: length 10.7
  Top Layer w0.508: CN6.3 CN6.4 C1.1
$1N10636: length 17.3
  Top Layer w0.508: U2.3 30.48,57.46 C1.2 27.43,65.66 R5.1
$1N10673: length 15.1
  Top Layer w0.508: R6.1 U2.4
  Bottom Layer w0.508: R6.1 R7.2
$1N10727: length 8.4
  Top Layer w0.508: W2.2 P1.2

## Copper pours and planes (outline as drawn; the poured copper is in the pictures)
GND on Bottom Layer: 1.27,68.71 88.65,68.71 88.65,1.27 1.27,1.27

Small or netless copper shapes (teardrops, artwork), in the pictures only: 86 on Top Layer, 14 on Bottom Layer

## Text on the board
Top Silkscreen Layer: CS | SCLK | DOUT | DIN | 3.3V | GND | 5V | PLJ | K | A | RST | PSB | E | RW | RS | V0 | VCC | +5V | CNMR-D-02 | 24-01-22

# Board CNMR-D-01
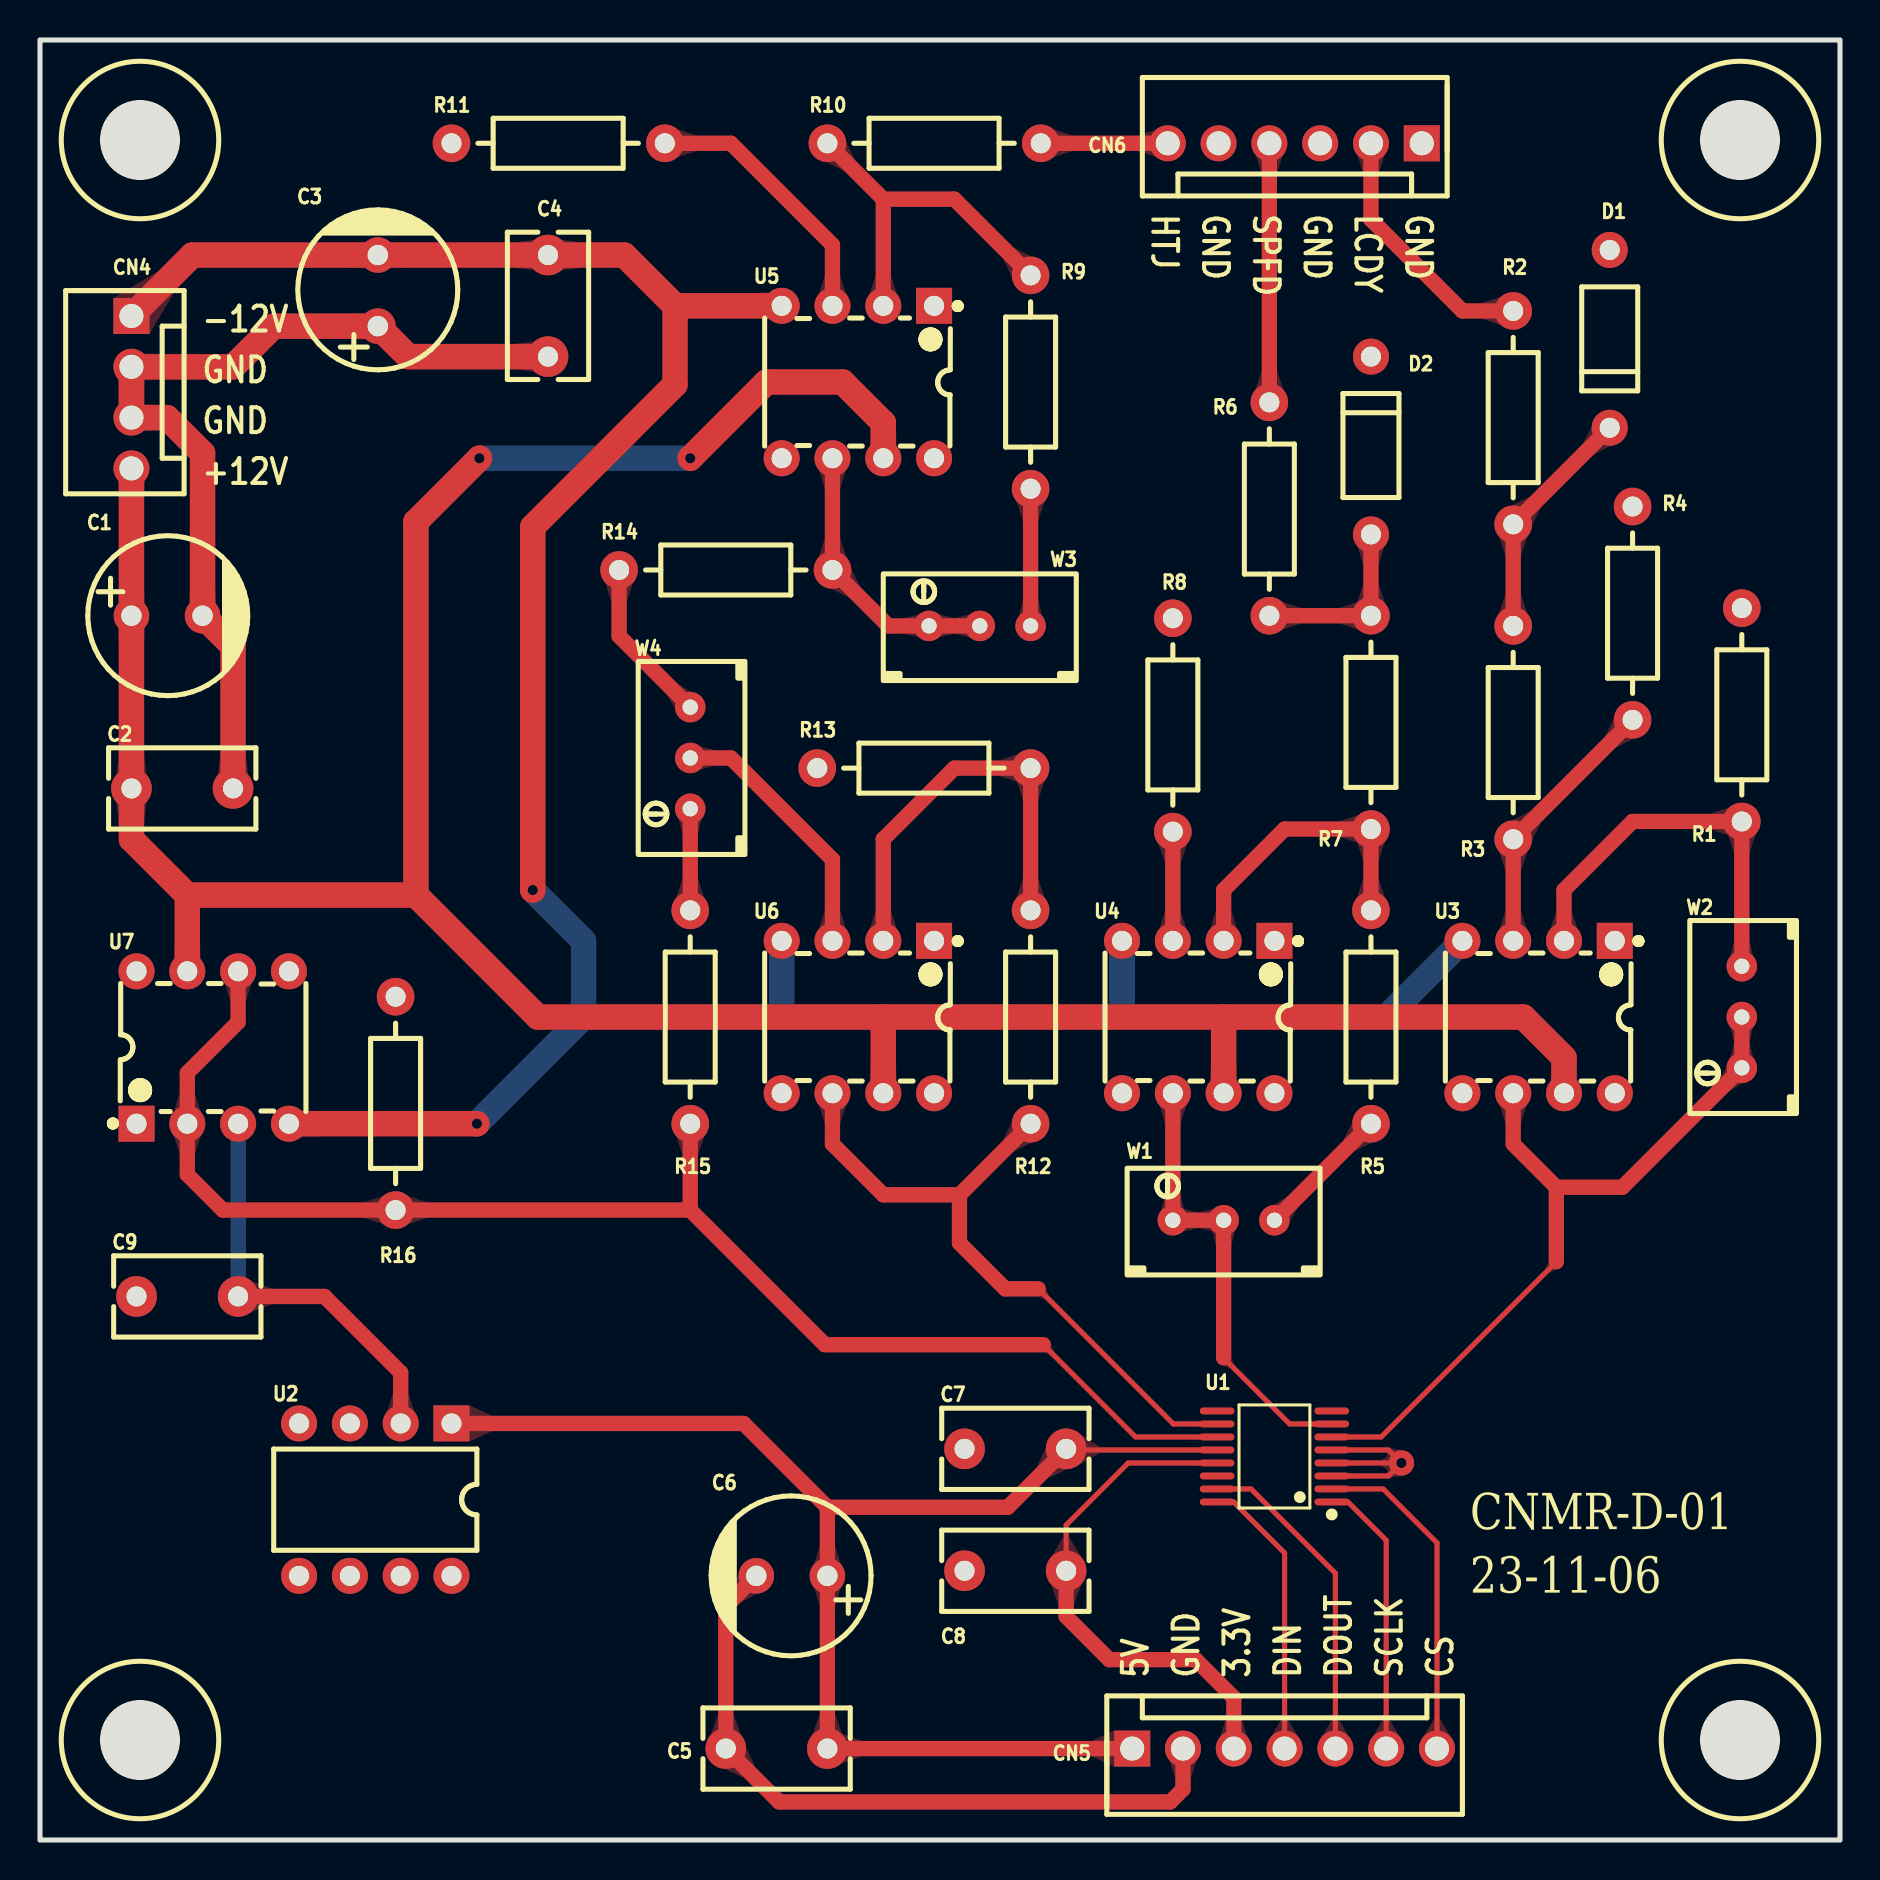
[diagram p4: board, top side]
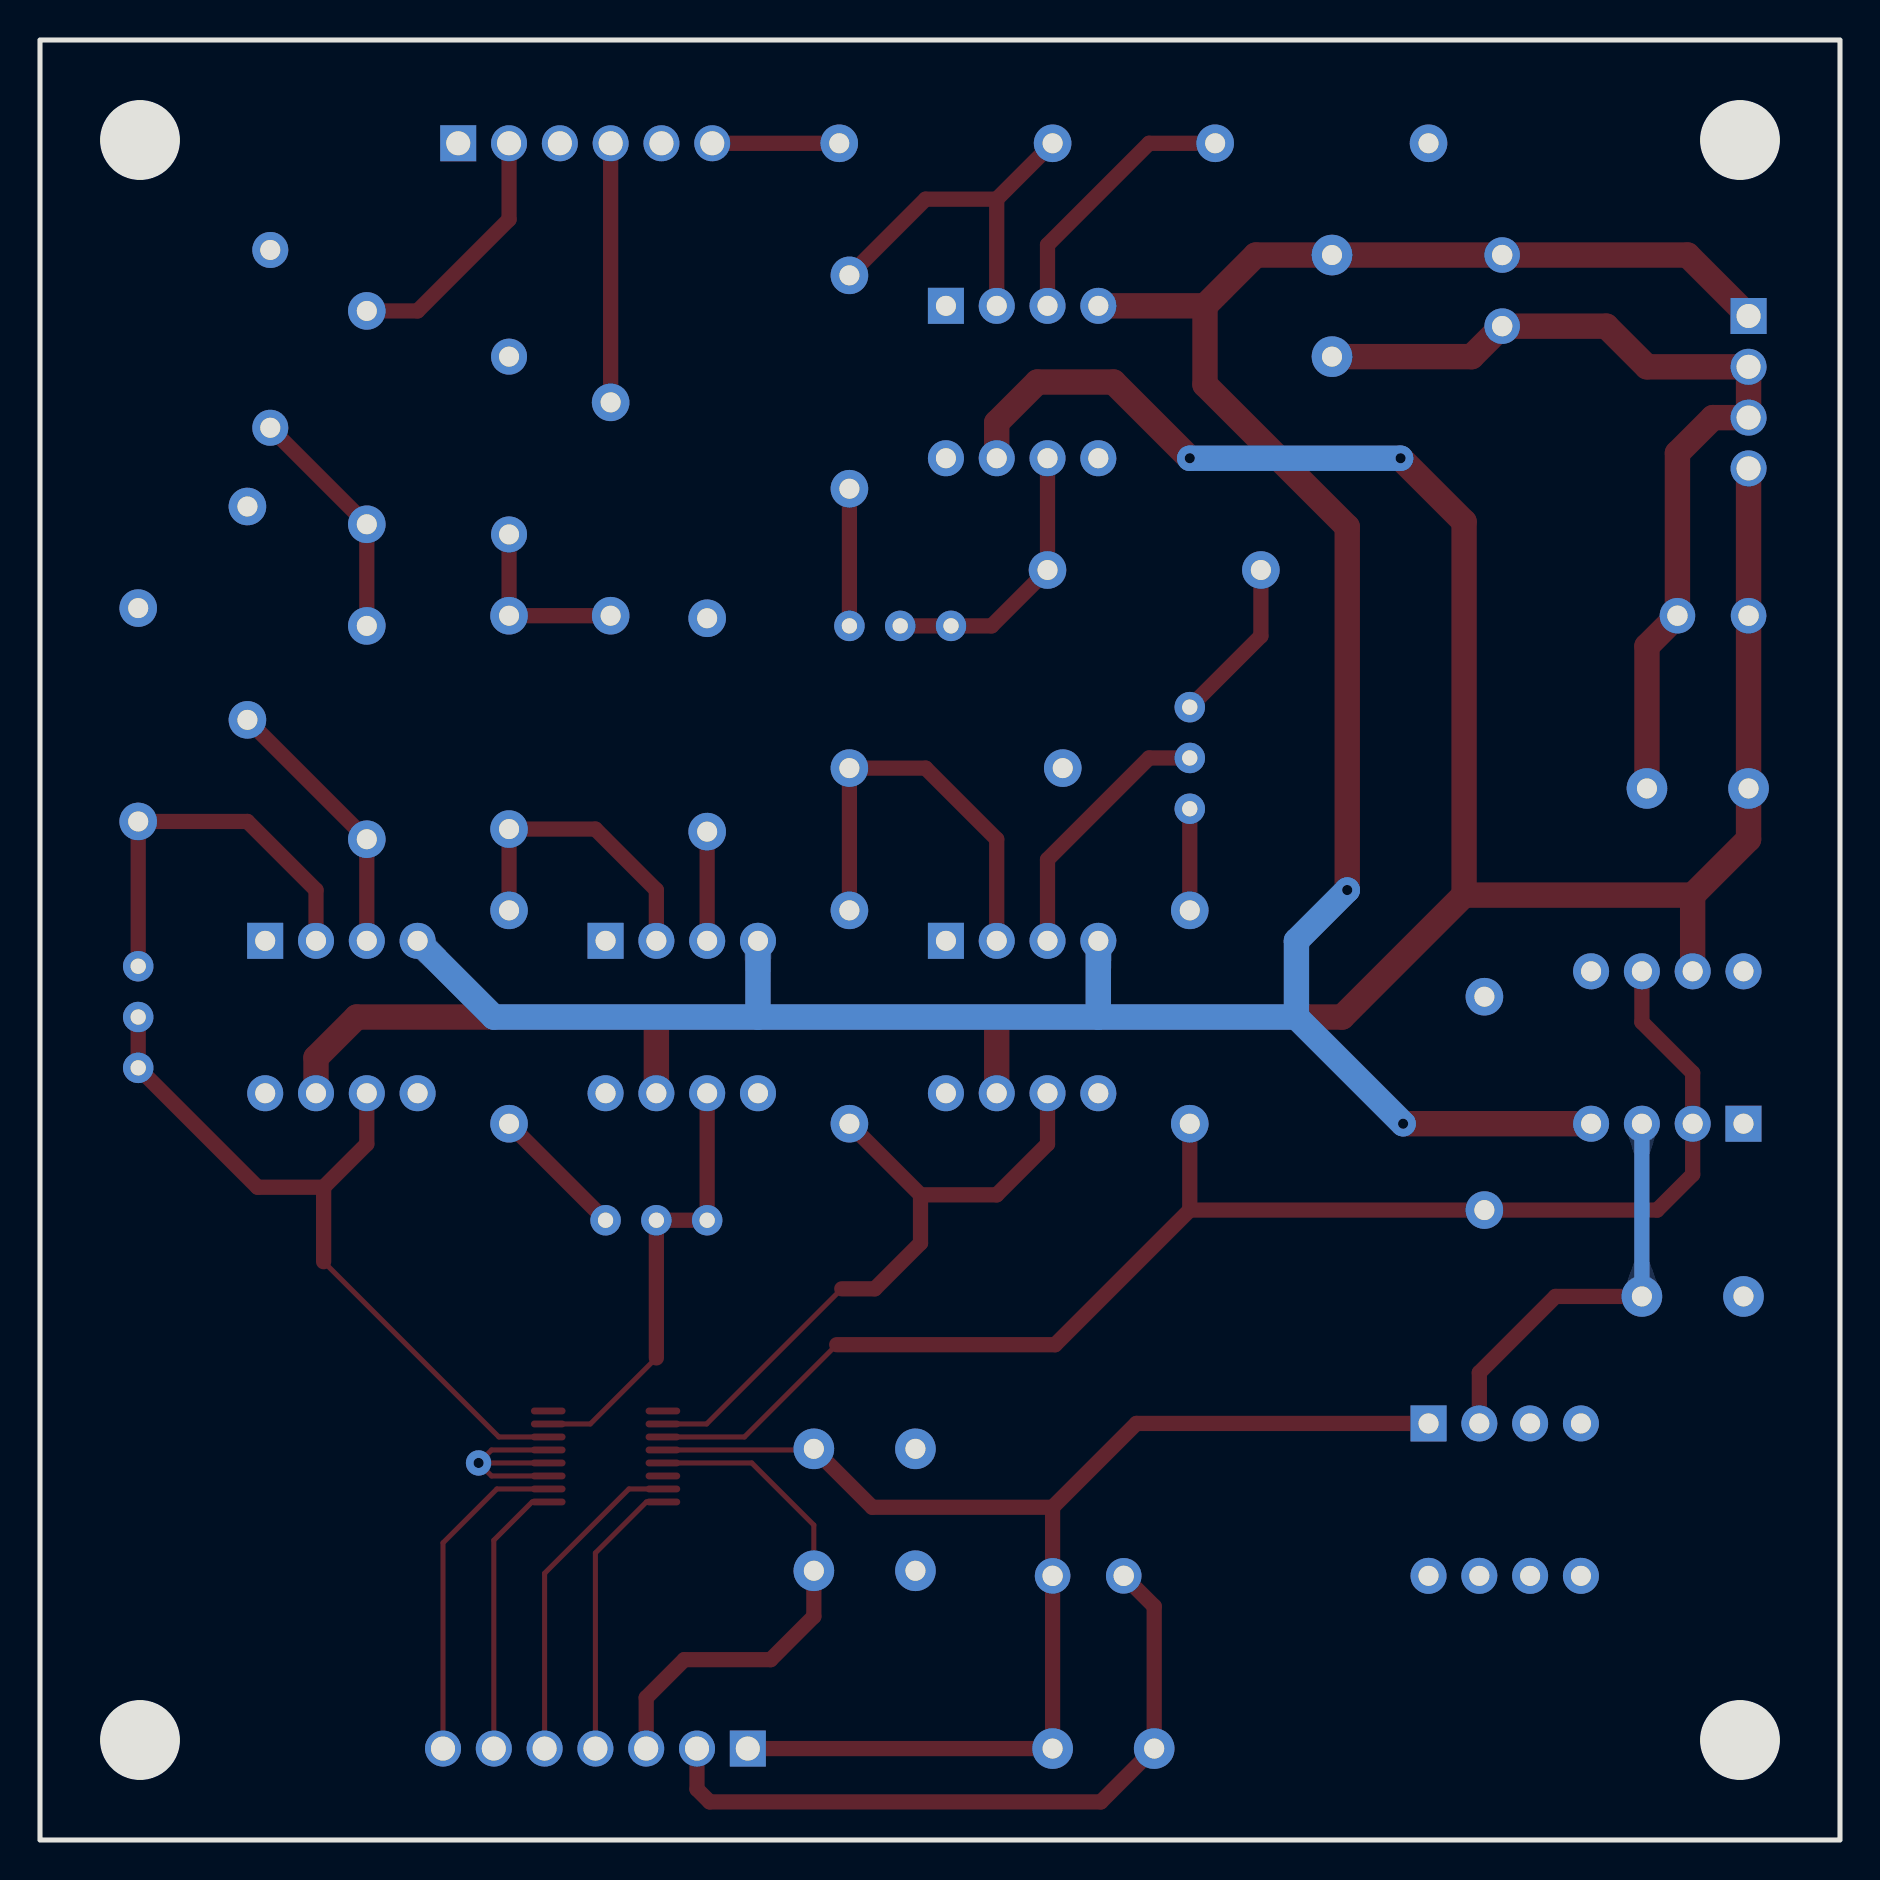
[diagram p5: board, bottom side, seen from below]

Outline 90 x 90 mm; copper layers: Top Layer, Bottom Layer. Coordinates in mm from the lower left corner of the outline.
Outline path: rectangle 0,90 90,0
Stack: Top Layer 0.035mm / Dielectric1 1.51mm FR4 er 4.5 / Bottom Layer 0.035mm

## Design rules (mm)
spacing safeClearance (default): track to track 0.152, other pairs 0.152 to 0.3
track width trackWidth (default): min 0.127, default 0.254, max 2.54
differential pair differentialPair (default): width min 0.127, default 0.254, max 2.54; gap min 0.152, default 0.152
via viaSize (default): diameter min 0.5, default 0.61, max 10; hole min 0.3, default 0.305, max 6

## Placement (name value [footprint] x y rotation side)
A1  -  [POST_4mm]  5 5 0 top
A2  -  [POST_4mm]  85 5 0 top
A3  -  [POST_4mm]  5 85 0 top
A4  -  [POST_4mm]  85 85 0 top
C1  16V/470uF  [CAP-TH_BD8.0-P3.50-D0.6-FD]  6.35 61.21 0 top
C2  104  [CAP-TH_L7.2-W4.0-P5.00-D0.5]  7.11 52.58 0 top
C3  16V/470uF  [CAP-TH_BD8.0-P3.50-D0.6-FD]  16.89 77.47 90 top
C4  104  [CAP-TH_L7.2-W4.0-P5.00-D0.5]  25.4 76.71 90 top
C5  104  [CAP-TH_L7.2-W4.0-P5.00-D0.5]  36.83 4.57 180 top
C6  16V/470uF  [CAP-TH_BD8.0-P3.50-D0.6-FD]  37.59 13.21 180 top
C7  104  [CAP-TH_L7.2-W4.0-P5.00-D0.5]  48.77 19.56 180 top
C8  104  [CAP-TH_L7.2-W4.0-P5.00-D0.5]  48.77 13.46 180 top
C9  104  [CAP-TH_L7.2-W4.0-P5.00-D0.5]  7.37 27.18 180 top
CN4  12V电源  [CONN-TH_4P-P2.54_A2510S-4P]  4.57 72.39 270 top
CN5  控制信号  [CH_7P-P2.54]  62.23 4.57 0 top
CN6  输入电压  [CH_6P-P2.54]  62.74 84.84 180 top
D1  1N4007  [DO-41_BD2.4-L4.7-P8.70-D0.9-RD]  78.49 75.06 90 top
D2  1N4007  [DO-41_BD2.4-L4.7-P8.70-D0.9-RD]  66.55 69.72 270 top
R1  1kΩ  [RES-TH_BD2.5-L6.5-P10.50-D0.6]  85.09 56.26 90 top
R2  5.1kΩ  [RES-TH_BD2.5-L6.5-P10.50-D0.6]  73.66 71.12 90 top
R3  10kΩ  [RES-TH_BD2.5-L6.5-P10.50-D0.6]  73.66 55.37 90 top
R4  2.7kΩ  [RES-TH_BD2.5-L6.5-P10.50-D0.6]  79.63 61.34 270 top
R5  3.3kΩ  [RES-TH_BD2.5-L6.5-P10.50-D0.6]  66.55 41.15 90 top
R6  5.1kΩ  [RES-TH_BD2.5-L6.5-P10.50-D0.6]  61.47 66.55 90 top
R7  10kΩ  [RES-TH_BD2.5-L6.5-P10.50-D0.6]  66.55 55.88 90 top
R8  1kΩ  [RES-TH_BD2.5-L6.5-P10.50-D0.6]  56.64 55.75 270 top
R9  3.9kΩ  [RES-TH_BD2.5-L6.5-P10.50-D0.6]  49.53 72.9 90 top
R10  10kΩ  [RES-TH_BD2.5-L6.5-P10.50-D0.6]  44.7 84.84 0 top
R11  1kΩ  [RES-TH_BD2.5-L6.5-P10.50-D0.6]  25.91 84.84 0 top
R12  10kΩ  [RES-TH_BD2.5-L6.5-P10.50-D0.6]  49.53 41.15 90 top
R13  10kΩ  [RES-TH_BD2.5-L6.5-P10.50-D0.6]  44.2 53.59 180 top
R14  10kΩ  [RES-TH_BD2.5-L6.5-P10.50-D0.6]  34.29 63.5 180 top
R15  10kΩ  [RES-TH_BD2.5-L6.5-P10.50-D0.6]  32.51 41.15 270 top
R16  10kΩ  [RES-TH_BD2.5-L6.5-P10.50-D0.6]  17.78 36.83 270 top
U1  ADS1220IPWR  [TSSOP-16_L5.0-W4.4-P0.65-LS6.4-BL]  61.72 19.18 90 top
U2  MC1403  [DIP-8_L9.7-W6.4-P2.54-LS7.6-BL]  16.76 17.02 180 top
U3  OP07  [DIP-8_L8.8-W6.4-P2.54-LS7.6-BL]  74.93 41.15 180 top
U4  OP07  [DIP-8_L8.8-W6.4-P2.54-LS7.6-BL]  57.91 41.15 180 top
U5  OP07  [DIP-8_L8.8-W6.4-P2.54-LS7.6-BL]  40.89 72.9 180 top
U6  OP07  [DIP-8_L8.8-W6.4-P2.54-LS7.6-BL]  40.89 41.15 180 top
U7  OP07  [DIP-8_L8.8-W6.4-P2.54-LS7.6-BL]  8.64 39.62 0 top
W1  1kΩ  [RES-ADJ-TH_3296W]  59.18 30.99 90 top
W2  1kΩ  [RES-ADJ-TH_3296W]  85.09 41.15 180 top
W3  2kΩ  [RES-ADJ-TH_3296W]  46.99 60.71 90 top
W4  1kΩ  [RES-ADJ-TH_3296W]  32.51 54.1 180 top

## Footprints (pads in the part's own frame, mm; a bottom-side part is the same pattern mirrored in y, then rotated)
CAP-TH_BD8.0-P3.50-D0.6-FD
  round 1.778 hole 1.016: 1(-1.778,0) 2(1.778,0)
CAP-TH_L7.2-W4.0-P5.00-D0.5
  round 2.032 hole 1.001: 1(-2.54,0) 2(2.54,0)
CH_6P-P2.54
  rect 1.8x1.8 hole 1.2: 1(-6.35,0)
  round 1.8 hole 1.2: 2(-3.81,0) 3(-1.27,0) 4(1.27,0) 5(3.81,0) 6(6.35,0)
CH_7P-P2.54
  rect 1.8x1.8 hole 1.2: 1(-7.62,0)
  round 1.8 hole 1.2: 2(-5.08,0) 3(-2.54,0) 4(0,0) 5(2.54,0) 6(5.08,0) 7(7.62,0)
CONN-TH_4P-P2.54_A2510S-4P
  rect 1.8x1.8 hole 1.2: 1(-3.81,0)
  round 1.8 hole 1.2: 2(-1.27,0) 3(1.27,0) 4(3.81,0)
DIP-8_L8.8-W6.4-P2.54-LS7.6-BL
  rect 1.801x1.801 hole 1.001: 1(-3.81,-3.81)
  round 1.801 hole 1.001: 2(-1.27,-3.81) 3(1.27,-3.81) 4(3.81,-3.81) 5(3.81,3.81) 6(1.27,3.81) 7(-1.27,3.81) 8(-3.81,3.81)
DIP-8_L9.7-W6.4-P2.54-LS7.6-BL
  rect 1.801x1.801 hole 1.001: 1(-3.81,-3.81)
  round 1.801 hole 1.001: 2(-1.27,-3.81) 3(1.27,-3.81) 4(3.81,-3.81) 5(3.81,3.81) 6(1.27,3.81) 7(-1.27,3.81) 8(-3.81,3.81)
DO-41_BD2.4-L4.7-P8.70-D0.9-RD
  round 1.8 hole 1: 1(-4.445,0) 2(4.445,0)
RES-ADJ-TH_3296W
  round 1.524 hole 0.762: 1(0,2.54) 2(0,0) 3(0,-2.54)
RES-TH_BD2.5-L6.5-P10.50-D0.6
  round 1.879 hole 1: 1(-5.334,0) 2(5.334,0)
TSSOP-16_L5.0-W4.4-P0.65-LS6.4-BL
  oval 0.343x1.732 smd: 1(-2.275,-2.866) 2(-1.625,-2.866) 3(-0.975,-2.866) 4(-0.325,-2.866) 5(0.325,-2.866) 6(0.975,-2.866) 7(1.625,-2.866) 8(2.275,-2.866) 9(2.275,2.866) 10(1.625,2.866) 11(0.975,2.866) 12(0.325,2.866) 13(-0.325,2.866) 14(-0.975,2.866) 15(-1.625,2.866) 16(-2.275,2.866)

## Nets
As in the schematic.

Pads without a net: U1 8 9 14; U2 4 5 6 7 8; U3 1 5 8; U4 1 5 8; U5 1 5 8; U6 1 5 8; U7 1 5 8

## Via types
v1: diameter 1.27, hole 0.508, Top Layer to Bottom Layer, 5 vias

## Routing (per net, layer and track width the routed paths; a pad name or vN(x,y) marks a point on that pad's centre or on a via; arc(x,y) is an arc through that point)
2.5V: length 72.5
  Top Layer w0.254: 50.16,24.77 54.78,20.15 U1.11
  Top Layer w0.762: 32.51,31.5 39.24,24.77 50.16,24.77 ; 32.51,31.5 R15.2 ; 32.51,31.5 R16.2 9.14,31.5 7.37,33.27 U7.2 7.37,38.35 9.91,40.89 U7.6
+3.3V: length 26
  Top Layer w0.254: C8.1 51.31,15.75 54.41,18.85 U1.13
  Top Layer w0.762: CN5.3 59.69,7.11 57.78,9.02 53.47,9.02 51.31,11.18 C8.1
+5V: length 68.6
  Top Layer w0.254: C7.1 51.36,19.5 U1.12
  Top Layer w0.762: 39.37,16.64 35.18,20.83 U2.1 ; 39.37,16.64 C6.1 C5.1 CN5.1 ; 39.37,16.64 48.39,16.64 C7.1
+12V: length 155.5
  Top Layer w1.27: v1(21.97,69.09) 18.8,65.91 18.8,47.24 ; U4.7 59.18,41.15 ; 59.18,41.15 74.17,41.15 76.2,39.12 U3.7 ; 59.18,41.15 42.16,41.15 ; 42.16,41.15 24.89,41.15 18.8,47.24 ; 42.16,41.15 U6.7 ; 7.37,47.24 U7.7 ; 7.37,47.24 4.57,50.04 C2.1 C1.1 CN4.4 ; 7.37,47.24 18.8,47.24 ; v1(32.51,69.09) 36.32,72.9 40.13,72.9 42.16,70.87 U5.7
  Bottom Layer w1.27: v1(32.51,69.09) v1(21.97,69.09)
-12V: length 144.5
  Top Layer w1.27: v1(21.84,35.81) U7.4 ; CN4.1 7.62,79.25 C3.2 C4.2 29.21,79.25 31.75,76.71 ; 31.75,76.71 U5.4 ; 31.75,76.71 31.75,72.77 24.64,65.66 v1(24.64,47.5)
  Bottom Layer w1.27: 54.1,41.15 37.08,41.15 ; 54.1,41.15 67.31,41.15 U3.4 ; 54.1,41.15 U4.4 ; 37.08,41.15 U6.4 ; 37.08,41.15 27.18,41.15 ; v1(21.84,35.81) 27.18,41.15 ; 27.18,41.15 27.18,44.96 v1(24.64,47.5)
GND: length 93
  Top Layer w0.254: U1.4 v1(68.07,18.85) ; v1(68.07,18.85) 67.42,19.5 U1.5 ; v1(68.07,18.85) 67.42,18.2 U1.3
  Top Layer w0.762: C6.2 34.29,11.68 C5.2 36.96,1.91 56.51,1.91 57.15,2.54 CN5.2
  Top Layer w1.27: C2.2 9.65,59.69 C1.2 8.13,69.34 6.35,71.12 CN4.3 CN4.2 9.65,73.66 11.68,75.69 C3.1 18.42,74.17 C4.1
1220_CS: length 16.7
  Top Layer w0.254: CN5.7 69.85,14.86 67.16,17.55 U1.2
1220_DIN: length 14.2
  Top Layer w0.254: U1.16 59.68,16.9 62.23,14.35 CN5.4
1220_DOUT: length 16.4
  Top Layer w0.254: U1.15 60.55,17.55 64.77,13.34 CN5.5
1220_SCLK: length 13.9
  Top Layer w0.254: CN5.6 67.31,14.99 65.39,16.9 U1.1
HTJ: length 6.3
  Top Layer w0.762: R10.2 CN6.6
HTJCJ: length 34
  Top Layer w0.254: U1.10 56.67,20.8 49.91,27.56
  Top Layer w0.762: 45.97,32.26 42.16,32.26 39.62,34.8 U6.6 ; 45.97,32.26 R12.1 ; 45.97,32.26 45.97,29.84 48.26,27.56 49.91,27.56
LCDY: length 12.8
  Top Layer w0.762: CN6.2 66.55,81.03 71.12,76.45 R2.2
LCDYCJ: length 38.5
  Top Layer w0.254: U1.6 67.06,20.15 75.82,28.92
  Top Layer w0.762: 75.82,32.64 79.12,32.64 W2.1 W2.2 ; 75.82,32.64 73.66,34.8 U3.6 ; 75.82,32.64 75.82,28.92
SPFD: length 13
  Top Layer w0.762: CN6.4 R6.2
SPFDCJ: length 22.5
  Top Layer w0.254: U1.7 62.48,20.8 59.18,24.1
  Top Layer w0.762: 59.18,24.1 W1.2 W1.1 U4.6
$1N38292: length 11.9
  Top Layer w0.762: D1.1 R2.1 R3.2
$1N39030: length 13.5
  Top Layer w0.762: U3.3 R3.1 79.63,56.01
$1N39217: length 20.1
  Top Layer w0.762: W2.3 85.09,50.93 79.63,50.93 76.2,47.5 U3.2
$1N40668: length 9.1
  Top Layer w0.762: D2.2 R7.2 R6.1
$1N42755: length 6.8
  Top Layer w0.762: R5.1 W1.3
$1N42829: length 5.5
  Top Layer w0.762: U4.3 R8.2
$1N42908: length 15.2
  Top Layer w0.762: U4.2 59.18,47.5 62.23,50.55 R7.1 R5.2
$1N44133: length 13.5
  Top Layer w0.762: R11.2 34.54,84.84 39.62,79.76 U5.3
$1N44135: length 6.9
  Top Layer w0.762: W3.3 R9.1
$1N44142: length 18.2
  Top Layer w0.762: 42.16,82.04 U5.2 ; 42.16,82.04 45.72,82.04 R9.2 ; 42.16,82.04 R10.1
$1N44433: length 13.3
  Top Layer w0.762: U6.3 39.62,49.02 34.54,54.1 W4.2
$1N44437: length 8.3
  Top Layer w0.762: R14.2 28.96,60.2 W4.3
$1N44441: length 5.1
  Top Layer w0.762: W4.1 R15.1
$1N44491: length 14.1
  Top Layer w0.762: W3.2 W3.1 42.42,60.71 R14.1 U5.6
$1N44512: length 21
  Top Layer w0.762: U6.2 42.16,50.04 45.72,53.59 R13.1 R12.2
$1N44757: length 20.9
  Top Layer w0.762: U2.2 18.03,23.37 14.22,27.18 C9.1
  Bottom Layer w0.762: U7.3 C9.1

## Copper pours and planes (outline as drawn; the poured copper is in the pictures)
GND on Bottom Layer: 1.27,88.65 88.65,88.65 88.65,1.27 1.27,1.27

Small or netless copper shapes (teardrops, artwork), in the pictures only: 136 on Top Layer, 5 on Bottom Layer

## Text on the board
Top Silkscreen Layer: HTJ | GND | SPFD | LCDY | -12V | +12V | 5V | 3.3V | DIN | DOUT | SCLK | CS | CNMR-D-01 | 23-11-06
